# EAGLE schematic 20150319_QSE_TO_FMC_DP_R5.6_FOR_REVIEW (EAGLE 7.2.0), part 1 of 2

## Sheet 1 of 5: HS Diff Links
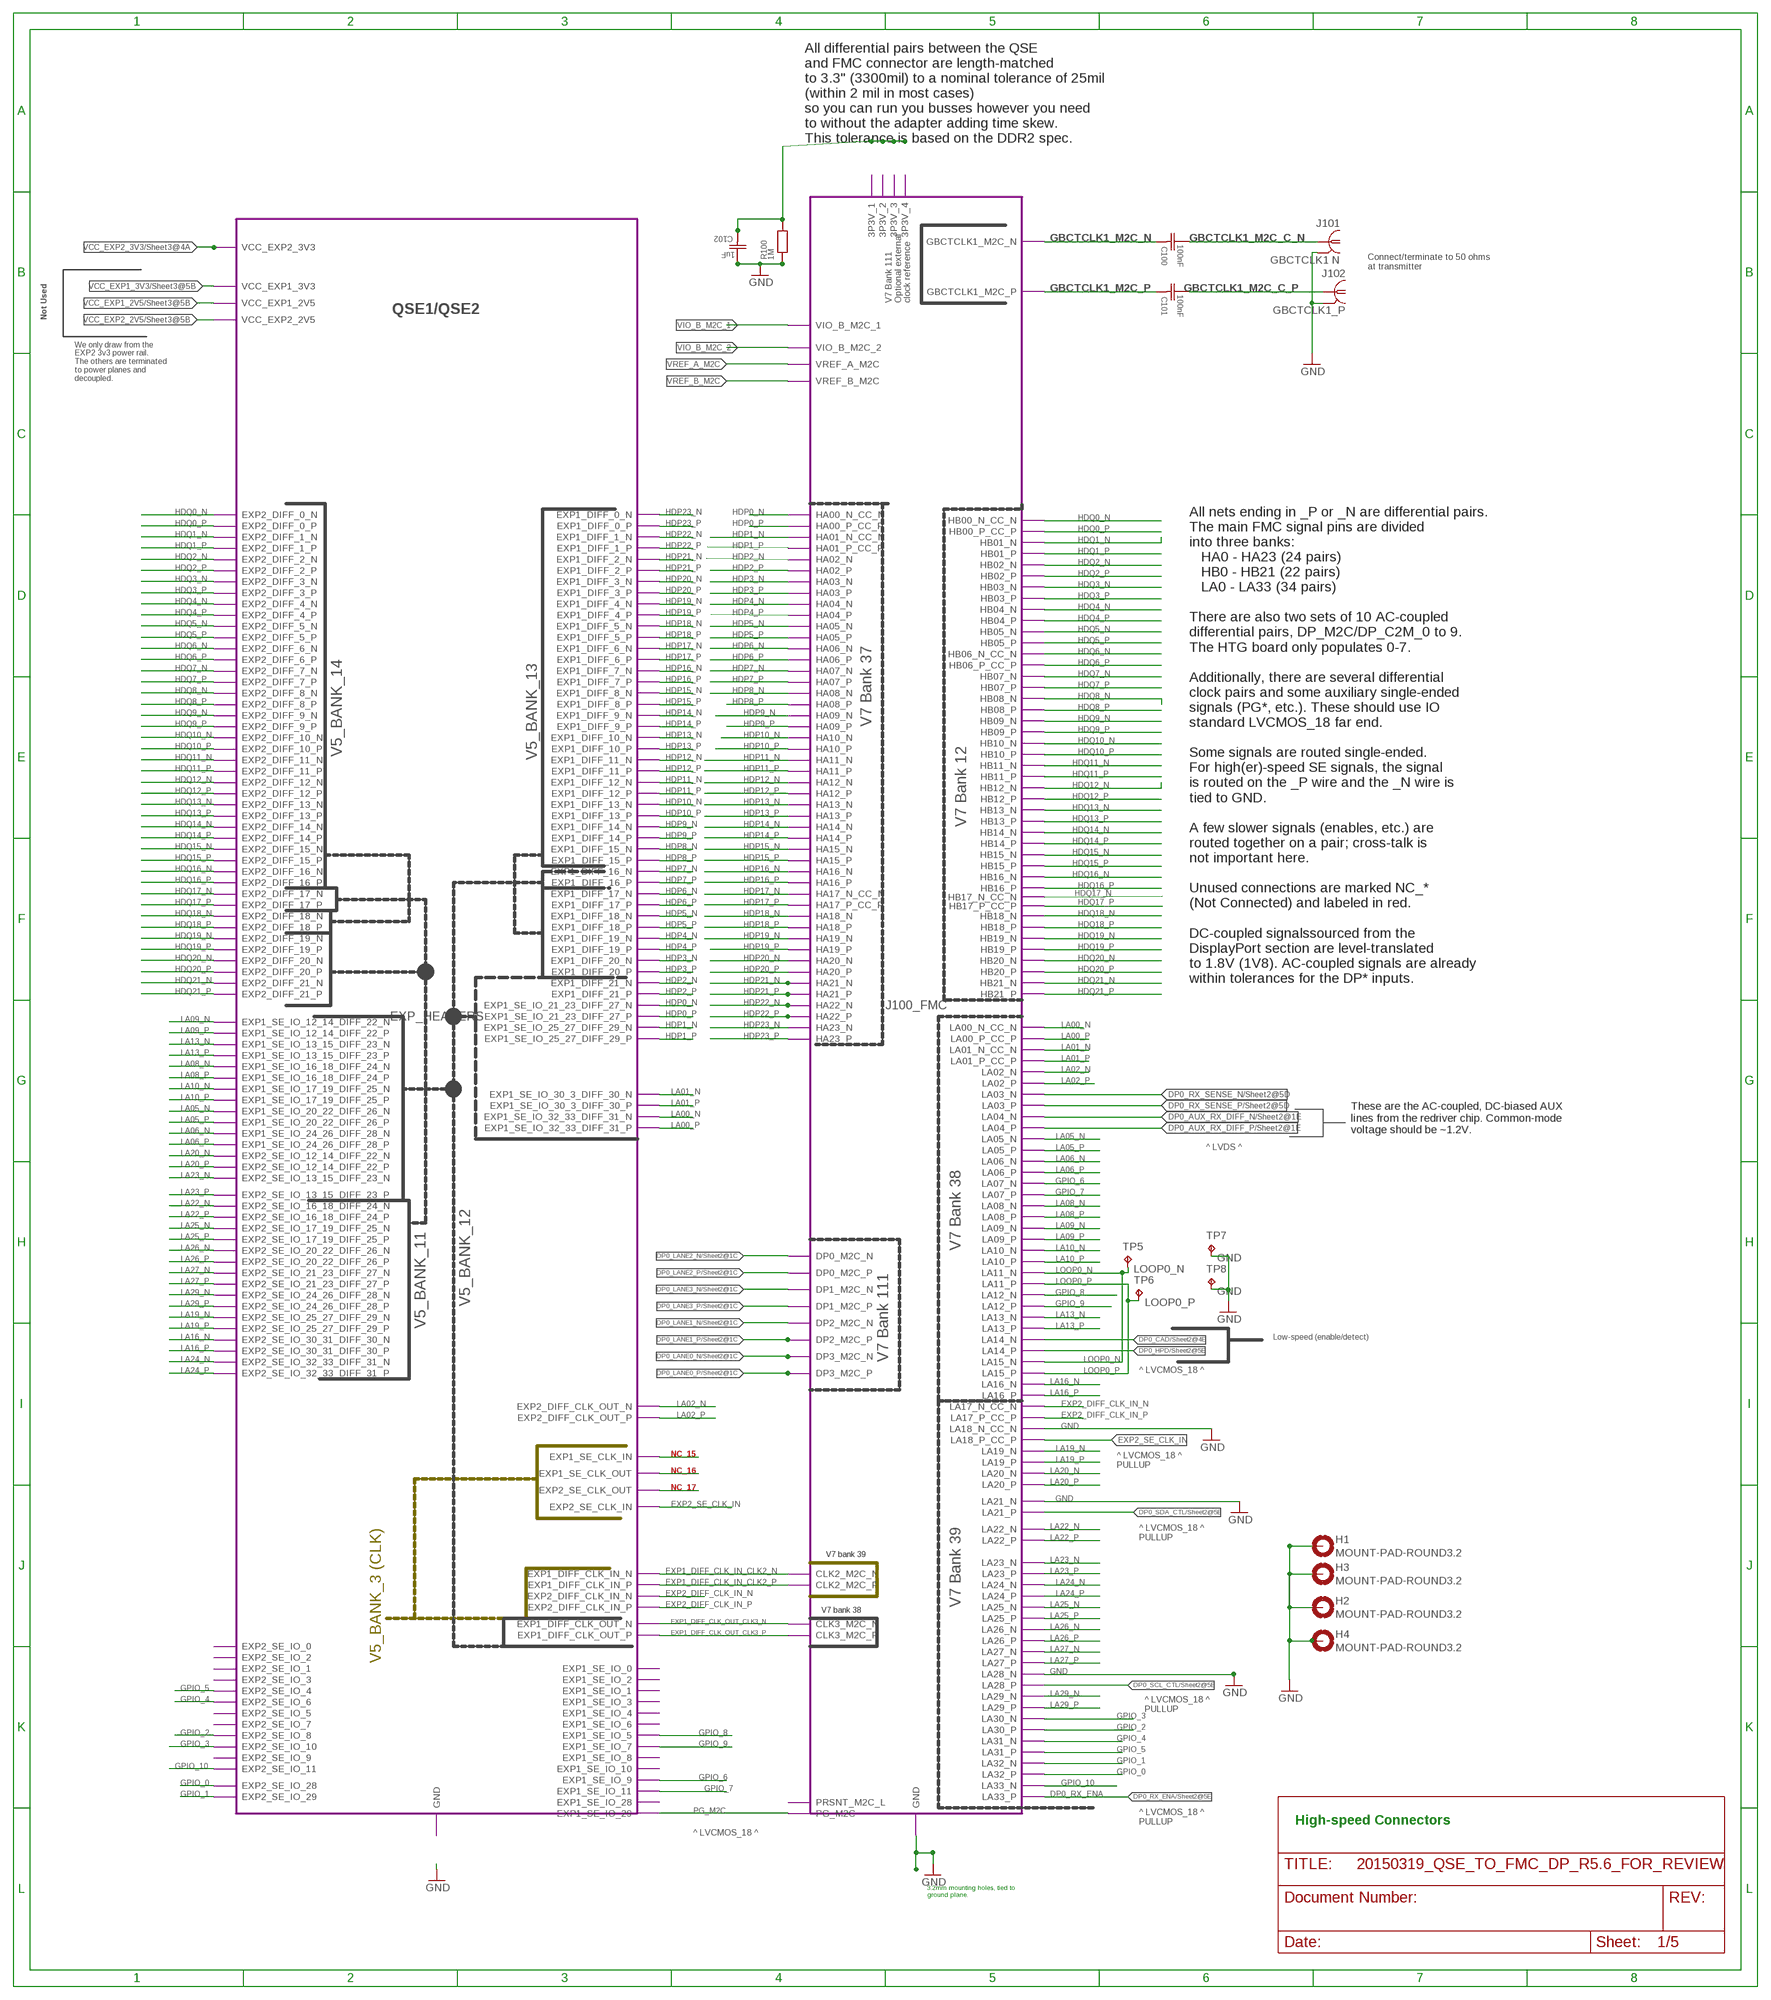
[diagram p0: schematic, sheet 1]

### Parts
C100  100nF  GRM155R71C104KA88D  [CAPC1005X60N]
C101  100nF  GRM155R71C104KA88D  [CAPC1005X60N]
C102  1uF  GRM155R61A105KE15D  [CAPC1005X60N]
H1  MOUNT-PAD-ROUND3.2  [3,2-PAD]
H2  MOUNT-PAD-ROUND3.2  [3,2-PAD]
H3  MOUNT-PAD-ROUND3.2  [3,2-PAD]
H4  MOUNT-PAD-ROUND3.2  [3,2-PAD]
J101  GBCTCLK1 N  SMA-SMD  [SMA-SMD]
J102  GBCTCLK1_P  SMA-SMD  [SMA-SMD]
R100  1M  CRCW04021M00JNED  [RESC1005X40N]
TP5  LOOP0_N  TPTP06R  [TP06R]
TP6  LOOP0_P  TPTP06R  [TP06R]
TP7  GND  TPTP06R  [TP06R]
TP8  GND  TPTP06R  [TP06R]

### Module instances
EXP_HEADERS = EXT_1_EXT_2 (part numbers offset by 400)
J100_FMC = FMC1

### Nets
DP0_AUX_RX_DIFF_N [diff_sig]: port J100_FMC.LA04_N ; also sheet 2
DP0_AUX_RX_DIFF_P [diff_sig]: port J100_FMC.LA04_P ; also sheet 2
DP0_CAD [gen_sig]: port J100_FMC.LA14_N ; also sheet 2
DP0_HPD [gen_sig]: port J100_FMC.LA14_P ; also sheet 2
DP0_LANE0_N [diff_sig]: port J100_FMC.DP3_M2C_N ; also sheet 2
DP0_LANE0_P [diff_sig]: port J100_FMC.DP3_M2C_P ; also sheet 2
DP0_LANE1_N [diff_sig]: port J100_FMC.DP2_M2C_N ; also sheet 2
DP0_LANE1_P [diff_sig]: port J100_FMC.DP2_M2C_P ; also sheet 2
DP0_LANE2_N [diff_sig]: port J100_FMC.DP0_M2C_N ; also sheet 2
DP0_LANE2_P [diff_sig]: port J100_FMC.DP0_M2C_P ; also sheet 2
DP0_LANE3_N [diff_sig]: port J100_FMC.DP1_M2C_N ; also sheet 2
DP0_LANE3_P [diff_sig]: port J100_FMC.DP1_M2C_P ; also sheet 2
DP0_RX_ENA [gen_sig]: port J100_FMC.LA33_P ; also sheet 2
DP0_RX_SENSE_N [diff_sig]: port J100_FMC.LA03_N ; also sheet 2
DP0_RX_SENSE_P [diff_sig]: port J100_FMC.LA03_P ; also sheet 2
DP0_SCL_CTL [gen_sig]: port J100_FMC.LA28_P ; also sheet 2
DP0_SDA_CTL [gen_sig]: port J100_FMC.LA21_P ; also sheet 2
EXP1_DIFF_CLK_IN_CLK2_N [diff_sig]: port J100_FMC.CLK2_M2C_N EXP_HEADERS.EXP1_DIFF_CLK_IN_N
EXP1_DIFF_CLK_IN_CLK2_P [diff_sig]: port EXP_HEADERS.EXP1_DIFF_CLK_IN_P J100_FMC.CLK2_M2C_P
EXP1_DIFF_CLK_OUT_CLK3_N [diff_sig]: port J100_FMC.CLK3_M2C_N EXP_HEADERS.EXP1_DIFF_CLK_OUT_N
EXP1_DIFF_CLK_OUT_CLK3_P [diff_sig]: port J100_FMC.CLK3_M2C_P EXP_HEADERS.EXP1_DIFF_CLK_OUT_P
EXP2_DIFF_CLK_IN_N [diff_sig]: port EXP_HEADERS.EXP2_DIFF_CLK_IN_N J100_FMC.LA17_N_CC_N
EXP2_DIFF_CLK_IN_P [diff_sig]: port EXP_HEADERS.EXP2_DIFF_CLK_IN_P J100_FMC.LA17_P_CC_P
EXP2_SE_CLK_IN [diff_sig]: port EXP_HEADERS.EXP2_SE_CLK_IN J100_FMC.LA18_P_CC_P
FMC_3PV3_TERM: C102.2 R100.1 ; port J100_FMC.3P3V_4 J100_FMC.3P3V_3 J100_FMC.3P3V_2 J100_FMC.3P3V_1
GBCTCLK1_M2C_C_N [DP]: C100.1 J101.1
GBCTCLK1_M2C_C_P [DP]: C101.1 J102.1
GBCTCLK1_M2C_N [diff_sig]: C100.2 ; port J100_FMC.GBCTCLK1_M2C_N
GBCTCLK1_M2C_P [diff_sig]: C101.2 ; port J100_FMC.GBCTCLK1_M2C_P
GND [GND]: C102.1 H1.B3,2(MOUNT) H2.B3,2(MOUNT) H3.B3,2(MOUNT) H4.B3,2(MOUNT) J101.2@1 J101.2@2 J101.2@3 J101.2@4 J101.2@5 J101.2@6 J102.2@1 J102.2@2 J102.2@3 J102.2@4 J102.2@5 J102.2@6 R100.2 TP7.TP TP8.TP ; port EXP_HEADERS.GND J100_FMC.GND J100_FMC.LA18_N_CC_N J100_FMC.LA28_N J100_FMC.LA21_N ; also sheet 2,3
GPIO_0 [DP]: port EXP_HEADERS.EXP2_SE_IO_28 J100_FMC.LA32_P
GPIO_1 [DP]: port EXP_HEADERS.EXP2_SE_IO_29 J100_FMC.LA32_N
GPIO_2 [DP]: port J100_FMC.LA30_P EXP_HEADERS.EXP2_SE_IO_8
GPIO_3 [DP]: port J100_FMC.LA30_N EXP_HEADERS.EXP2_SE_IO_10
GPIO_4 [DP]: port J100_FMC.LA31_N EXP_HEADERS.EXP2_SE_IO_6
GPIO_5 [DP]: port J100_FMC.LA31_P EXP_HEADERS.EXP2_SE_IO_4
GPIO_6 [DP]: port J100_FMC.LA07_N EXP_HEADERS.EXP1_SE_IO_9
GPIO_7 [DP]: port J100_FMC.LA07_P EXP_HEADERS.EXP1_SE_IO_11
GPIO_8 [DP]: port J100_FMC.LA12_N EXP_HEADERS.EXP1_SE_IO_5
GPIO_9 [DP]: port J100_FMC.LA12_P EXP_HEADERS.EXP1_SE_IO_7
GPIO_10 [DP]: port J100_FMC.LA33_N EXP_HEADERS.EXP2_SE_IO_11
HDP0_N [diff_sig]: port J100_FMC.HA00_N_CC_N EXP_HEADERS.EXP1_SE_IO_21_23_DIFF_27_N
HDP0_P [diff_sig]: port J100_FMC.HA00_P_CC_P EXP_HEADERS.EXP1_SE_IO_21_23_DIFF_27_P
HDP1_N [diff_sig]: port J100_FMC.HA01_N_CC_N EXP_HEADERS.EXP1_SE_IO_25_27_DIFF_29_N
HDP1_P [diff_sig]: port J100_FMC.HA01_P_CC_P EXP_HEADERS.EXP1_SE_IO_25_27_DIFF_29_P
HDP2_N [diff_sig]: port J100_FMC.HA02_N EXP_HEADERS.EXP1_DIFF_21_N
HDP2_P [diff_sig]: port J100_FMC.HA02_P EXP_HEADERS.EXP1_DIFF_21_P
HDP3_N [diff_sig]: port J100_FMC.HA03_N EXP_HEADERS.EXP1_DIFF_20_N
HDP3_P [diff_sig]: port J100_FMC.HA03_P EXP_HEADERS.EXP1_DIFF_20_P
HDP4_N [diff_sig]: port J100_FMC.HA04_N EXP_HEADERS.EXP1_DIFF_19_N
HDP4_P [diff_sig]: port J100_FMC.HA04_P EXP_HEADERS.EXP1_DIFF_19_P
HDP5_N [diff_sig]: port J100_FMC.HA05_N EXP_HEADERS.EXP1_DIFF_18_N
HDP5_P [diff_sig]: port J100_FMC.HA05_P EXP_HEADERS.EXP1_DIFF_18_P
HDP6_N [diff_sig]: port J100_FMC.HA06_N EXP_HEADERS.EXP1_DIFF_17_N
HDP6_P [diff_sig]: port J100_FMC.HA06_P EXP_HEADERS.EXP1_DIFF_17_P
HDP7_N [diff_sig]: port J100_FMC.HA07_N EXP_HEADERS.EXP1_DIFF_16_N
HDP7_P [diff_sig]: port J100_FMC.HA07_P EXP_HEADERS.EXP1_DIFF_16_P
HDP8_N [diff_sig]: port J100_FMC.HA08_N EXP_HEADERS.EXP1_DIFF_15_N
HDP8_P [diff_sig]: port J100_FMC.HA08_P EXP_HEADERS.EXP1_DIFF_15_P
HDP9_N [diff_sig]: port J100_FMC.HA09_N EXP_HEADERS.EXP1_DIFF_14_N
HDP9_P [diff_sig]: port J100_FMC.HA09_P EXP_HEADERS.EXP1_DIFF_14_P
HDP10_N [diff_sig]: port J100_FMC.HA10_N EXP_HEADERS.EXP1_DIFF_13_N
HDP10_P [diff_sig]: port J100_FMC.HA10_P EXP_HEADERS.EXP1_DIFF_13_P
HDP11_N [diff_sig]: port J100_FMC.HA11_N EXP_HEADERS.EXP1_DIFF_12_N
HDP11_P [diff_sig]: port J100_FMC.HA11_P EXP_HEADERS.EXP1_DIFF_12_P
HDP12_N [diff_sig]: port J100_FMC.HA12_N EXP_HEADERS.EXP1_DIFF_11_N
HDP12_P [diff_sig]: port J100_FMC.HA12_P EXP_HEADERS.EXP1_DIFF_11_P
HDP13_N [diff_sig]: port J100_FMC.HA13_N EXP_HEADERS.EXP1_DIFF_10_N
HDP13_P [diff_sig]: port J100_FMC.HA13_P EXP_HEADERS.EXP1_DIFF_10_P
HDP14_N [diff_sig]: port J100_FMC.HA14_N EXP_HEADERS.EXP1_DIFF_9_N
HDP14_P [diff_sig]: port J100_FMC.HA14_P EXP_HEADERS.EXP1_DIFF_9_P
HDP15_N [diff_sig]: port J100_FMC.HA15_N EXP_HEADERS.EXP1_DIFF_8_N
HDP15_P [diff_sig]: port J100_FMC.HA15_P EXP_HEADERS.EXP1_DIFF_8_P
HDP16_N [diff_sig]: port J100_FMC.HA16_N EXP_HEADERS.EXP1_DIFF_7_N
HDP16_P [diff_sig]: port J100_FMC.HA16_P EXP_HEADERS.EXP1_DIFF_7_P
HDP17_N [diff_sig]: port J100_FMC.HA17_N_CC_N EXP_HEADERS.EXP1_DIFF_6_N
HDP17_P [diff_sig]: port J100_FMC.HA17_P_CC_P EXP_HEADERS.EXP1_DIFF_6_P
HDP18_N [diff_sig]: port J100_FMC.HA18_N EXP_HEADERS.EXP1_DIFF_5_N
HDP18_P [diff_sig]: port J100_FMC.HA18_P EXP_HEADERS.EXP1_DIFF_5_P
HDP19_N [diff_sig]: port J100_FMC.HA19_N EXP_HEADERS.EXP1_DIFF_4_N
HDP19_P [diff_sig]: port J100_FMC.HA19_P EXP_HEADERS.EXP1_DIFF_4_P
HDP20_N [diff_sig]: port J100_FMC.HA20_N EXP_HEADERS.EXP1_DIFF_3_N
HDP20_P [diff_sig]: port J100_FMC.HA20_P EXP_HEADERS.EXP1_DIFF_3_P
HDP21_N [diff_sig]: port J100_FMC.HA21_N EXP_HEADERS.EXP1_DIFF_2_N
HDP21_P [diff_sig]: port J100_FMC.HA21_P EXP_HEADERS.EXP1_DIFF_2_P
HDP22_N [diff_sig]: port J100_FMC.HA22_N EXP_HEADERS.EXP1_DIFF_1_N
HDP22_P [diff_sig]: port J100_FMC.HA22_P EXP_HEADERS.EXP1_DIFF_1_P
HDP23_N [diff_sig]: port J100_FMC.HA23_N EXP_HEADERS.EXP1_DIFF_0_N
HDP23_P [diff_sig]: port J100_FMC.HA23_P EXP_HEADERS.EXP1_DIFF_0_P
HDQ0_N [diff_sig]: port J100_FMC.HB00_N_CC_N EXP_HEADERS.EXP2_DIFF_0_N
HDQ0_P [diff_sig]: port J100_FMC.HB00_P_CC_P EXP_HEADERS.EXP2_DIFF_0_P
HDQ1_N [diff_sig]: port J100_FMC.HB01_N EXP_HEADERS.EXP2_DIFF_1_N
HDQ1_P [diff_sig]: port J100_FMC.HB01_P EXP_HEADERS.EXP2_DIFF_1_P
HDQ2_N [diff_sig]: port J100_FMC.HB02_N EXP_HEADERS.EXP2_DIFF_2_N
HDQ2_P [diff_sig]: port J100_FMC.HB02_P EXP_HEADERS.EXP2_DIFF_2_P
HDQ3_N [diff_sig]: port J100_FMC.HB03_N EXP_HEADERS.EXP2_DIFF_3_N
HDQ3_P [diff_sig]: port J100_FMC.HB03_P EXP_HEADERS.EXP2_DIFF_3_P
HDQ4_N [diff_sig]: port J100_FMC.HB04_N EXP_HEADERS.EXP2_DIFF_4_N
HDQ4_P [diff_sig]: port J100_FMC.HB04_P EXP_HEADERS.EXP2_DIFF_4_P
HDQ5_N [diff_sig]: port J100_FMC.HB05_N EXP_HEADERS.EXP2_DIFF_5_N
HDQ5_P [diff_sig]: port J100_FMC.HB05_P EXP_HEADERS.EXP2_DIFF_5_P
HDQ6_N [diff_sig]: port J100_FMC.HB06_N_CC_N EXP_HEADERS.EXP2_DIFF_6_N
HDQ6_P [diff_sig]: port J100_FMC.HB06_P_CC_P EXP_HEADERS.EXP2_DIFF_6_P
HDQ7_N [diff_sig]: port J100_FMC.HB07_N EXP_HEADERS.EXP2_DIFF_7_N
HDQ7_P [diff_sig]: port J100_FMC.HB07_P EXP_HEADERS.EXP2_DIFF_7_P
HDQ8_N [diff_sig]: port J100_FMC.HB08_N EXP_HEADERS.EXP2_DIFF_8_N
HDQ8_P [diff_sig]: port J100_FMC.HB08_P EXP_HEADERS.EXP2_DIFF_8_P
HDQ9_N [diff_sig]: port J100_FMC.HB09_N EXP_HEADERS.EXP2_DIFF_9_N
HDQ9_P [diff_sig]: port J100_FMC.HB09_P EXP_HEADERS.EXP2_DIFF_9_P
HDQ10_N [diff_sig]: port J100_FMC.HB10_N EXP_HEADERS.EXP2_DIFF_10_N
HDQ10_P [diff_sig]: port J100_FMC.HB10_P EXP_HEADERS.EXP2_DIFF_10_P
HDQ11_N [diff_sig]: port J100_FMC.HB11_N EXP_HEADERS.EXP2_DIFF_11_N
HDQ11_P [diff_sig]: port J100_FMC.HB11_P EXP_HEADERS.EXP2_DIFF_11_P
HDQ12_N [diff_sig]: port J100_FMC.HB12_N EXP_HEADERS.EXP2_DIFF_12_N
HDQ12_P [diff_sig]: port J100_FMC.HB12_P EXP_HEADERS.EXP2_DIFF_12_P
HDQ13_N [diff_sig]: port J100_FMC.HB13_N EXP_HEADERS.EXP2_DIFF_13_N
HDQ13_P [diff_sig]: port J100_FMC.HB13_P EXP_HEADERS.EXP2_DIFF_13_P
HDQ14_N [diff_sig]: port J100_FMC.HB14_N EXP_HEADERS.EXP2_DIFF_14_N
HDQ14_P [diff_sig]: port J100_FMC.HB14_P EXP_HEADERS.EXP2_DIFF_14_P
HDQ15_N [diff_sig]: port J100_FMC.HB15_N EXP_HEADERS.EXP2_DIFF_15_N
HDQ15_P [diff_sig]: port J100_FMC.HB15_P EXP_HEADERS.EXP2_DIFF_15_P
HDQ16_N [diff_sig]: port J100_FMC.HB16_N EXP_HEADERS.EXP2_DIFF_16_N
HDQ16_P [diff_sig]: port J100_FMC.HB16_P EXP_HEADERS.EXP2_DIFF_16_P
HDQ17_N [diff_sig]: port J100_FMC.HB17_N_CC_N EXP_HEADERS.EXP2_DIFF_17_N
HDQ17_P [diff_sig]: port J100_FMC.HB17_P_CC_P EXP_HEADERS.EXP2_DIFF_17_P
HDQ18_N [diff_sig]: port J100_FMC.HB18_N EXP_HEADERS.EXP2_DIFF_18_N
HDQ18_P [diff_sig]: port J100_FMC.HB18_P EXP_HEADERS.EXP2_DIFF_18_P
HDQ19_N [diff_sig]: port J100_FMC.HB19_N EXP_HEADERS.EXP2_DIFF_19_N
HDQ19_P [diff_sig]: port J100_FMC.HB19_P EXP_HEADERS.EXP2_DIFF_19_P
HDQ20_N [diff_sig]: port J100_FMC.HB20_N EXP_HEADERS.EXP2_DIFF_20_N
HDQ20_P [diff_sig]: port J100_FMC.HB20_P EXP_HEADERS.EXP2_DIFF_20_P
HDQ21_N [diff_sig]: port J100_FMC.HB21_N EXP_HEADERS.EXP2_DIFF_21_N
HDQ21_P [diff_sig]: port J100_FMC.HB21_P EXP_HEADERS.EXP2_DIFF_21_P
LA00_N [diff_sig]: port J100_FMC.LA00_N_CC_N EXP_HEADERS.EXP1_SE_IO_32_33_DIFF_31_N
LA00_P [diff_sig]: port J100_FMC.LA00_P_CC_P EXP_HEADERS.EXP1_SE_IO_32_33_DIFF_31_P
LA01_N [diff_sig]: port J100_FMC.LA01_N_CC_N EXP_HEADERS.EXP1_SE_IO_30_3_DIFF_30_N
LA01_P [diff_sig]: port J100_FMC.LA01_P_CC_P EXP_HEADERS.EXP1_SE_IO_30_3_DIFF_30_P
LA02_N [diff_sig]: port J100_FMC.LA02_N EXP_HEADERS.EXP2_DIFF_CLK_OUT_N
LA02_P [diff_sig]: port J100_FMC.LA02_P EXP_HEADERS.EXP2_DIFF_CLK_OUT_P
LA05_N [diff_sig]: port J100_FMC.LA05_N EXP_HEADERS.EXP1_SE_IO_20_22_DIFF_26_N
LA05_P [diff_sig]: port J100_FMC.LA05_P EXP_HEADERS.EXP1_SE_IO_20_22_DIFF_26_P
LA06_N [diff_sig]: port J100_FMC.LA06_N EXP_HEADERS.EXP1_SE_IO_24_26_DIFF_28_N
LA06_P [diff_sig]: port J100_FMC.LA06_P EXP_HEADERS.EXP1_SE_IO_24_26_DIFF_28_P
LA08_N [diff_sig]: port J100_FMC.LA08_N EXP_HEADERS.EXP1_SE_IO_16_18_DIFF_24_N
LA08_P [diff_sig]: port J100_FMC.LA08_P EXP_HEADERS.EXP1_SE_IO_16_18_DIFF_24_P
LA09_N [diff_sig]: port J100_FMC.LA09_N EXP_HEADERS.EXP1_SE_IO_12_14_DIFF_22_N
LA09_P [diff_sig]: port J100_FMC.LA09_P EXP_HEADERS.EXP1_SE_IO_12_14_DIFF_22_P
LA10_N [diff_sig]: port J100_FMC.LA10_N EXP_HEADERS.EXP1_SE_IO_17_19_DIFF_25_N
LA10_P [diff_sig]: port J100_FMC.LA10_P EXP_HEADERS.EXP1_SE_IO_17_19_DIFF_25_P
LA13_N [diff_sig]: port J100_FMC.LA13_N EXP_HEADERS.EXP1_SE_IO_13_15_DIFF_23_N
LA13_P [diff_sig]: port J100_FMC.LA13_P EXP_HEADERS.EXP1_SE_IO_13_15_DIFF_23_P
LA16_N [diff_sig]: port J100_FMC.LA16_N EXP_HEADERS.EXP2_SE_IO_30_31_DIFF_30_N
LA16_P [diff_sig]: port J100_FMC.LA16_P EXP_HEADERS.EXP2_SE_IO_30_31_DIFF_30_P
LA19_N [diff_sig]: port J100_FMC.LA19_N EXP_HEADERS.EXP2_SE_IO_25_27_DIFF_29_N
LA19_P [diff_sig]: port J100_FMC.LA19_P EXP_HEADERS.EXP2_SE_IO_25_27_DIFF_29_P
LA20_N [diff_sig]: port EXP_HEADERS.EXP2_SE_IO_12_14_DIFF_22_N J100_FMC.LA20_N
LA20_P [diff_sig]: port EXP_HEADERS.EXP2_SE_IO_12_14_DIFF_22_P J100_FMC.LA20_P
LA22_N [diff_sig]: port J100_FMC.LA22_N EXP_HEADERS.EXP2_SE_IO_16_18_DIFF_24_N
LA22_P [diff_sig]: port J100_FMC.LA22_P EXP_HEADERS.EXP2_SE_IO_16_18_DIFF_24_P
LA23_N [diff_sig]: port J100_FMC.LA23_N EXP_HEADERS.EXP2_SE_IO_13_15_DIFF_23_N
LA23_P [diff_sig]: port EXP_HEADERS.EXP2_SE_IO_13_15_DIFF_23_P J100_FMC.LA23_P
LA24_N [diff_sig]: port J100_FMC.LA24_N EXP_HEADERS.EXP2_SE_IO_32_33_DIFF_31_N
LA24_P [diff_sig]: port J100_FMC.LA24_P EXP_HEADERS.EXP2_SE_IO_32_33_DIFF_31_P
LA25_N [diff_sig]: port EXP_HEADERS.EXP2_SE_IO_17_19_DIFF_25_N J100_FMC.LA25_N
LA25_P [diff_sig]: port EXP_HEADERS.EXP2_SE_IO_17_19_DIFF_25_P J100_FMC.LA25_P
LA26_N [diff_sig]: port EXP_HEADERS.EXP2_SE_IO_20_22_DIFF_26_N J100_FMC.LA26_N
LA26_P [diff_sig]: port EXP_HEADERS.EXP2_SE_IO_20_22_DIFF_26_P J100_FMC.LA26_P
LA27_N [diff_sig]: port EXP_HEADERS.EXP2_SE_IO_21_23_DIFF_27_N J100_FMC.LA27_N
LA27_P [diff_sig]: port EXP_HEADERS.EXP2_SE_IO_21_23_DIFF_27_P J100_FMC.LA27_P
LA29_N [diff_sig]: port EXP_HEADERS.EXP2_SE_IO_24_26_DIFF_28_N J100_FMC.LA29_N
LA29_P [diff_sig]: port EXP_HEADERS.EXP2_SE_IO_24_26_DIFF_28_P J100_FMC.LA29_P
LOOP0_N [diff_sig]: TP5.TP ; port J100_FMC.LA15_N J100_FMC.LA11_N
LOOP0_P [diff_sig]: TP6.TP ; port J100_FMC.LA11_P J100_FMC.LA15_P
NC_15 [DP]: port EXP_HEADERS.EXP1_SE_CLK_IN
NC_16 [DP]: port EXP_HEADERS.EXP1_SE_CLK_OUT
NC_17 [DP]: port EXP_HEADERS.EXP2_SE_CLK_OUT
PG_M2C [gen_sig]: port J100_FMC.PG_M2C EXP_HEADERS.EXP1_SE_IO_29
VCC_EXP1_2V5: port EXP_HEADERS.VCC_EXP1_2V5 ; also sheet 3
VCC_EXP1_3V3: port EXP_HEADERS.VCC_EXP1_3V3 ; also sheet 3
VCC_EXP2_2V5 [power]: port EXP_HEADERS.VCC_EXP2_2V5 ; also sheet 3
VCC_EXP2_3V3 [power]: port EXP_HEADERS.VCC_EXP2_3V3 ; also sheet 3
VIO_B_M2C_1: port J100_FMC.VIO_B_M2C_1
VIO_B_M2C_2: port J100_FMC.VIO_B_M2C_2
VREF_A_M2C: port J100_FMC.VREF_A_M2C
VREF_B_M2C: port J100_FMC.VREF_B_M2C

### Notes on the sheet
- All differential pairs between the QSE
  and FMC connector are length-matched
  to 3.3" (3300mil) to a nominal tolerance of 25mil
  (within 2 mil in most cases)
  so you can run you busses however you need 
  to without the adapter adding time skew. 
  This tolerance is based on the DDR2 spec.
- Connect/terminate to 50 ohms 
  at transmitter
- V7 Bank 111 
  Optional external
  clock reference
- QSE1/QSE2
- Not Used
- We only draw from the 
  EXP2 3v3 power rail.
  The others are terminated 
  to power planes and 
  decoupled.
- V5_BANK_14
- V7 Bank 37
- V5_BANK_13
- V7 Bank 12
- All nets ending in _P or _N are differential pairs. 
  The main FMC signal pins are divided 
  into three banks:
     HA0 - HA23 (24 pairs)
     HB0 - HB21 (22 pairs)
     LA0 - LA33 (34 pairs)
  
  There are also two sets of 10 AC-coupled
  differential pairs, DP_M2C/DP_C2M_0 to 9.
  The HTG board only populates 0-7.
  
  Additionally, there are several differential
  clock pairs and some auxiliary single-ended
  signals (PG*, etc.). These should use IO
  standard LVCMOS_18 far end.
  
  Some signals are routed single-ended.
  For high(er)-speed SE signals, the signal
  is routed on the _P wire and the _N wire is
  tied to GND.
  
  A few slower signals (enables, etc.) are 
  routed together on a pair; cross-talk is
  not important here.
  
  Unused connections are marked NC_* 
  (Not Connected) and labeled in red.
  
  DC-coupled signalssourced from the
  DisplayPort section are level-translated
  to 1.8V (1V8). AC-coupled signals are already
  within tolerances for the DP* inputs.
- These are the AC-coupled, DC-biased AUX
  lines from the redriver chip. Common-mode
  voltage should be ~1.2V.
- ^ LVDS ^
- V7 Bank 38
- V5_BANK_12
- V5_BANK_11
- Low-speed (enable/detect)
- V7 Bank 111
- ^ LVCMOS_18 ^
- ^ LVCMOS_18 ^
  PULLUP
- ^ LVCMOS_18 ^
  PULLUP
- V7 bank 39
- V7 Bank 39
- V7 bank 38
- V5_BANK_3 (CLK)
- ^ LVCMOS_18 ^
  PULLUP
- ^ LVCMOS_18 ^
  PULLUP
- High-speed Connectors
- ^ LVCMOS_18 ^
- 3.2mm mounting holes, tied to
  ground plane.

## Sheet 2 of 5: DisplayPort Circuitry
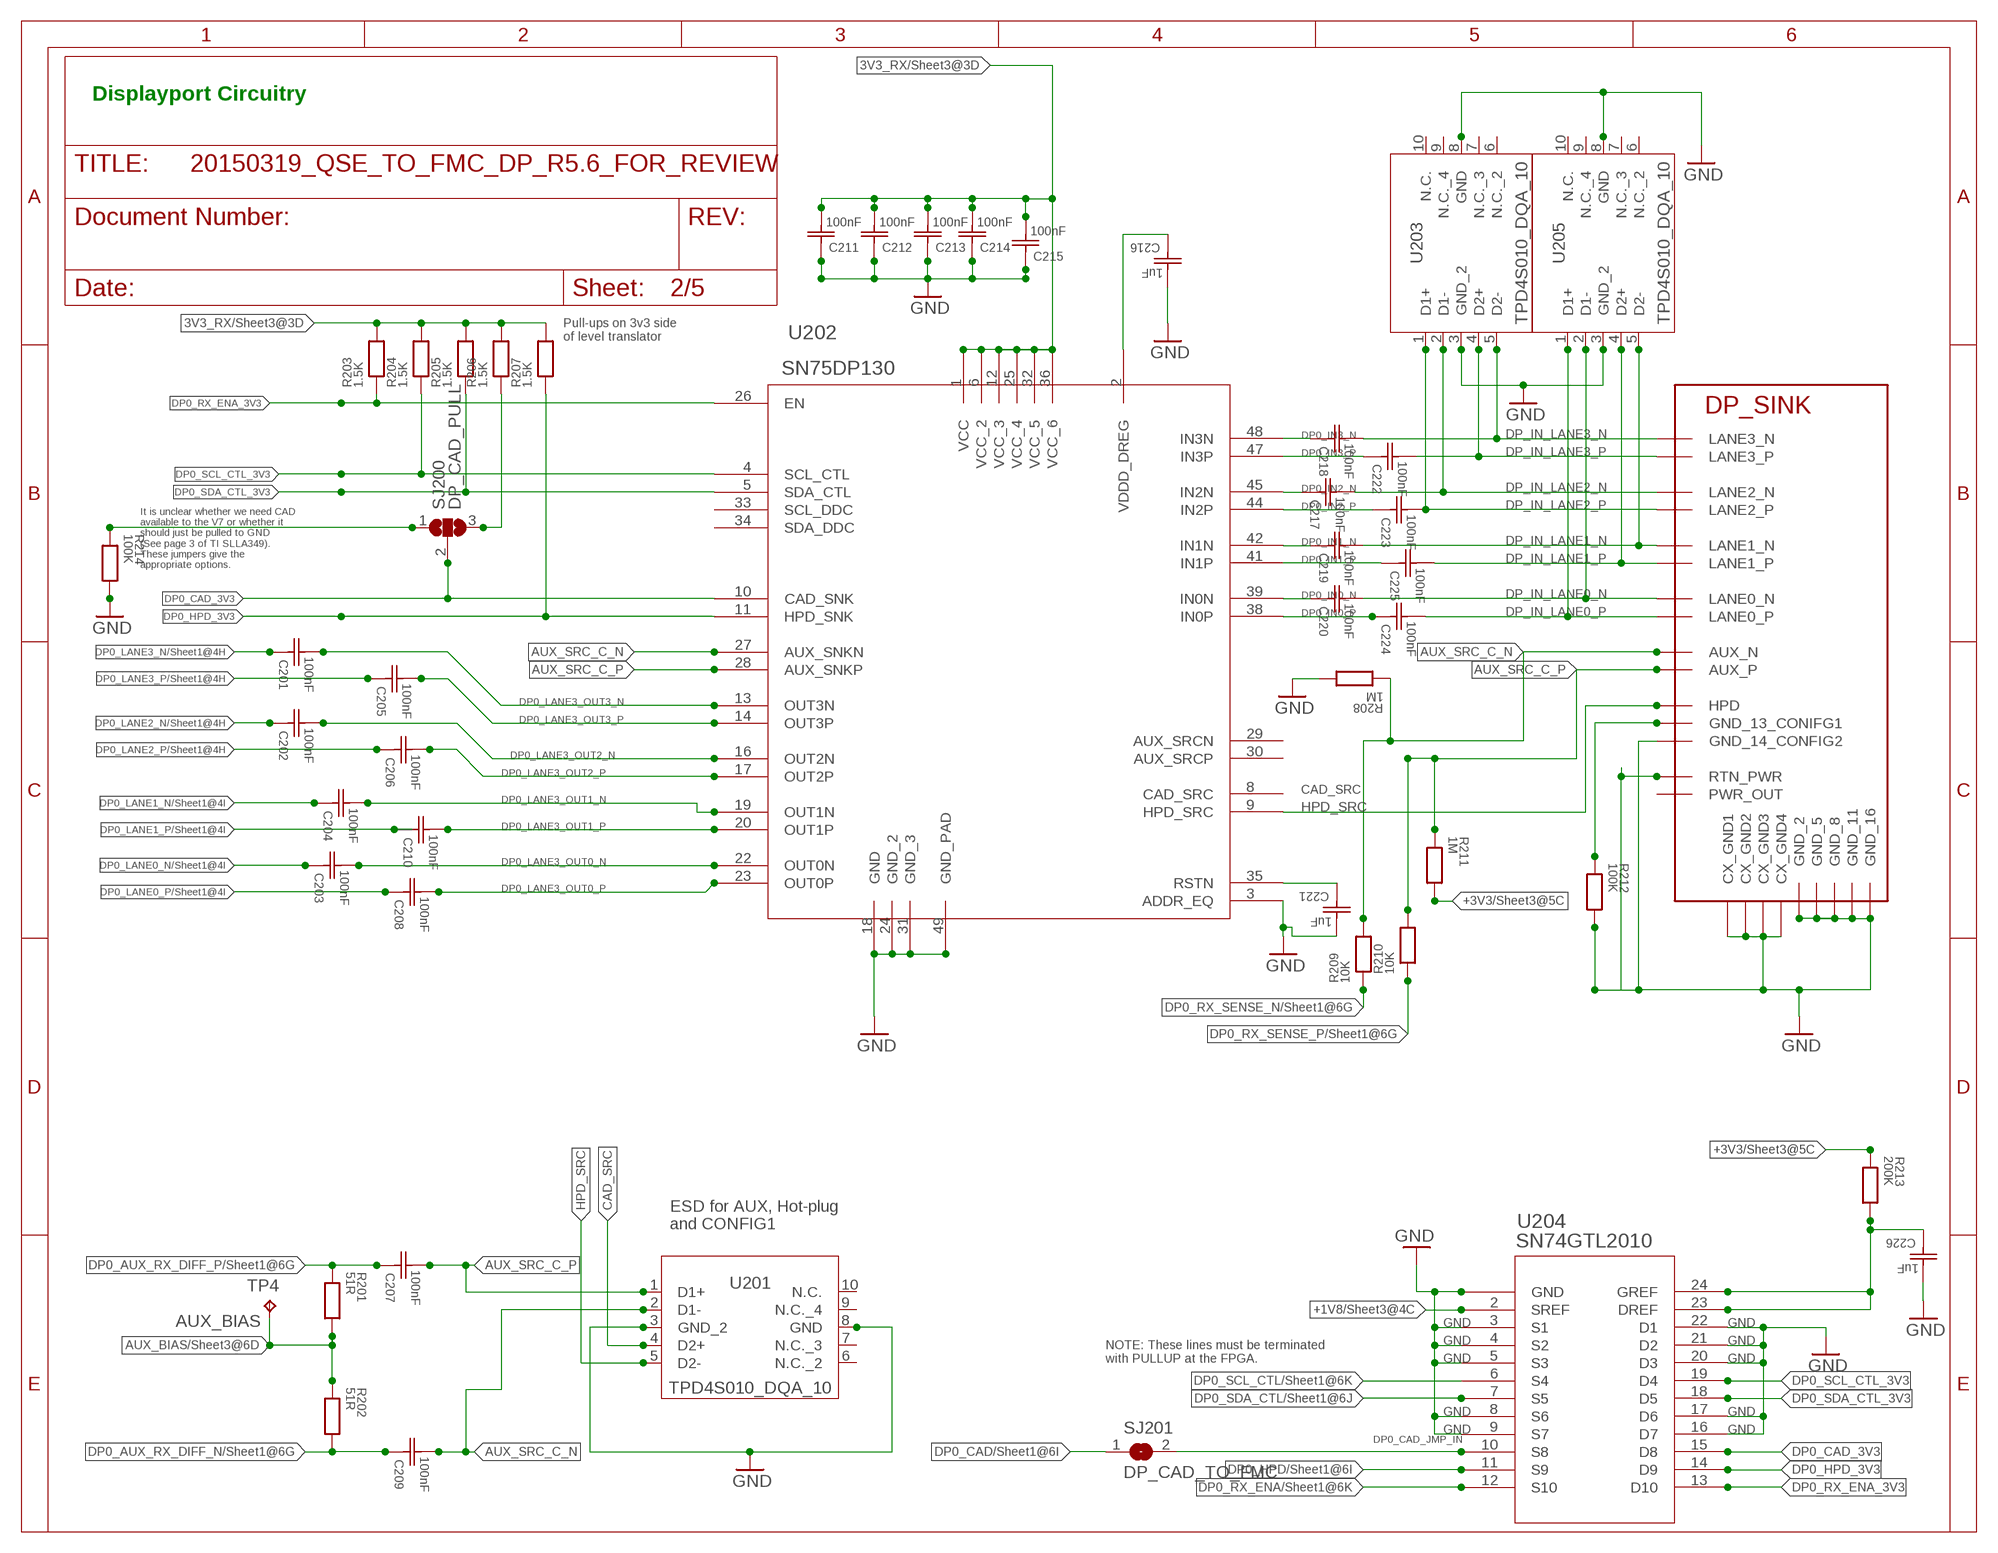
[diagram p1: schematic, sheet 2]

### Parts
C201  100nF  GRM155R71C104KA88D  [CAPC1005X60N]
C202  100nF  GRM155R71C104KA88D  [CAPC1005X60N]
C203  100nF  GRM155R71C104KA88D  [CAPC1005X60N]
C204  100nF  GRM155R71C104KA88D  [CAPC1005X60N]
C205  100nF  GRM155R71C104KA88D  [CAPC1005X60N]
C206  100nF  GRM155R71C104KA88D  [CAPC1005X60N]
C207  100nF  GRM155R71C104KA88D  [CAPC1005X60N]
C208  100nF  GRM155R71C104KA88D  [CAPC1005X60N]
C209  100nF  GRM155R71C104KA88D  [CAPC1005X60N]
C210  100nF  GRM155R71C104KA88D  [CAPC1005X60N]
C211  100nF  GRM155R71C104KA88D  [CAPC1005X60N]
C212  100nF  GRM155R71C104KA88D  [CAPC1005X60N]
C213  100nF  GRM155R71C104KA88D  [CAPC1005X60N]
C214  100nF  GRM155R71C104KA88D  [CAPC1005X60N]
C215  100nF  GRM155R71C104KA88D  [CAPC1005X60N]
C216  1uF  GRM155R61A105KE15D  [CAPC1005X60N]
C217  100nF  GRM155R71C104KA88D  [CAPC1005X60N]
C218  100nF  GRM155R71C104KA88D  [CAPC1005X60N]
C219  100nF  GRM155R71C104KA88D  [CAPC1005X60N]
C220  100nF  GRM155R71C104KA88D  [CAPC1005X60N]
C221  1uF  GRM155R61A105KE15D  [CAPC1005X60N]
C222  100nF  GRM155R71C104KA88D  [CAPC1005X60N]
C223  100nF  GRM155R71C104KA88D  [CAPC1005X60N]
C224  100nF  GRM155R71C104KA88D  [CAPC1005X60N]
C225  100nF  GRM155R71C104KA88D  [CAPC1005X60N]
C226  1uF  GRM155R61A105KE15D  [CAPC1005X60N]
R201  51R  CRCW040251R0FKED  [RESC1005X40N]
R202  51R  CRCW040251R0FKED  [RESC1005X40N]
R203  1.5K  CRCW04021K50FKED  [RESC1005X40N]
R204  1.5K  CRCW04021K50FKED  [RESC1005X40N]
R205  1.5K  CRCW04021K50FKED  [RESC1005X40N]
R206  1.5K  CRCW04021K50FKED  [RESC1005X40N]
R207  1.5K  CRCW04021K50FKED  [RESC1005X40N]
R208  1M  CRCW04021M00FKED  [RESC1005X40N]
R209  10K  CRCW040210K0JNED  [RESC1005X40N]
R210  10K  CRCW040210K0JNED  [RESC1005X40N]
R211  1M  CRCW04021M00FKED  [RESC1005X40N]
R212  100K  CRCW0402100KFKED  [RESC1005X40N]
R213  200K  CRCW0402200KJNED  [RESC1005X40N]
R214  100K  CRCW0402100KFKED  [RESC1005X40N]
SJ200  DP_CAD_PULL  SJ2W  [SJ_2]
SJ201  DP_CAD_TO_FMC  SJ  [SJ]
TP4  AUX_BIAS  TPTP10R  [TP10R]
U201  TPD4S010_DQA_10  [DQA10]
U202  SN75DP130  SN75DP130SN75DP130-SS  [RGZ48_5P6X5P6]
U203  TPD4S010_DQA_10  [DQA10]
U204  SN74GTL2010  SN74GTL2010_PW_24  [PW24]
U205  TPD4S010_DQA_10  [DQA10]
U206  DP0_IN  SD-47272DP_SINK  [SD-47272]

### Nets
3V3_RX [power]: C211.1 C212.1 C213.1 C214.1 C215.1 R203.1 R204.1 R205.1 R206.1 R207.1 U202.1(VCC) U202.6(VCC_2) U202.12(VCC_3) U202.25(VCC_4) U202.32(VCC_5) U202.36(VCC_6) ; also sheet 3
+1V8 [diff_sig]: U204.2(SREF) ; also sheet 3
+3V3 [power]: R211.1 R213.2 ; also sheet 3
AUX_BIAS [diff_sig]: R201.1 R202.2 TP4.TP ; also sheet 3
AUX_SRC_C_N [diff_sig]: C209.1 R208.2 R209.1 U201.2(D1-) U202.27(AUX_SNKN) U206.P$17(AUX_N)
AUX_SRC_C_P [diff_sig]: C207.1 R210.1 R211.2 U201.1(D1+) U202.28(AUX_SNKP) U206.P$15(AUX_P)
CAD_SRC [gen_sig]: R212.2 U201.4(D2+) U206.P$13(GND_13_CONIFG1)
DP0_AUX_RX_DIFF_N [diff_sig]: C209.2 R202.1 ; also sheet 1
DP0_AUX_RX_DIFF_P [diff_sig]: C207.2 R201.2 ; also sheet 1
DP0_CAD [gen_sig]: SJ201.1 ; also sheet 1
DP0_CAD_3V3 [diff_sig]: SJ200.2 U202.10(CAD_SNK) U204.15(D8)
DP0_CAD_JMP_IN [gen_sig]: SJ201.2 U204.10(S8)
DP0_HPD [gen_sig]: U204.11(S9) ; also sheet 1
DP0_HPD_3V3 [diff_sig]: R207.2 U202.11(HPD_SNK) U204.14(D9)
DP0_IN0_N [DP]: C220.2 U202.39(IN0N)
DP0_IN0_P [DP]: C224.2 U202.38(IN0P)
DP0_IN1_N [DP]: C219.2 U202.42(IN1N)
DP0_IN1_P [DP]: C225.2 U202.41(IN1P)
DP0_IN2_N [DP]: C217.2 U202.45(IN2N)
DP0_IN2_P [DP]: C223.2 U202.44(IN2P)
DP0_IN3_N [DP]: C218.2 U202.48(IN3N)
DP0_IN3_P [DP]: C222.2 U202.47(IN3P)
DP0_LANE0_N [diff_sig]: C203.2 ; also sheet 1
DP0_LANE0_P [diff_sig]: C208.2 ; also sheet 1
DP0_LANE1_N [diff_sig]: C204.2 ; also sheet 1
DP0_LANE1_P [diff_sig]: C210.2 ; also sheet 1
DP0_LANE2_N [diff_sig]: C202.2 ; also sheet 1
DP0_LANE2_P [diff_sig]: C206.2 ; also sheet 1
DP0_LANE3_N [diff_sig]: C201.2 ; also sheet 1
DP0_LANE3_OUT0_N [DP]: C203.1 U202.22(OUT0N)
DP0_LANE3_OUT0_P [DP]: C208.1 U202.23(OUT0P)
DP0_LANE3_OUT1_N [DP]: C204.1 U202.19(OUT1N)
DP0_LANE3_OUT1_P [DP]: C210.1 U202.20(OUT1P)
DP0_LANE3_OUT2_N [DP]: C202.1 U202.16(OUT2N)
DP0_LANE3_OUT2_P [DP]: C206.1 U202.17(OUT2P)
DP0_LANE3_OUT3_N [DP]: C201.1 U202.13(OUT3N)
DP0_LANE3_OUT3_P [DP]: C205.1 U202.14(OUT3P)
DP0_LANE3_P [diff_sig]: C205.2 ; also sheet 1
DP0_RX_ENA [gen_sig]: U204.12(S10) ; also sheet 1
DP0_RX_ENA_3V3 [diff_sig]: R203.2 U202.26(EN) U204.13(D10)
DP0_RX_SENSE_N [diff_sig]: R209.2 ; also sheet 1
DP0_RX_SENSE_P [diff_sig]: R210.2 ; also sheet 1
DP0_SCL_CTL [gen_sig]: U204.6(S4) ; also sheet 1
DP0_SCL_CTL_3V3 [gen_sig]: R204.2 U202.4(SCL_CTL) U204.19(D4)
DP0_SDA_CTL [gen_sig]: U204.7(S5) ; also sheet 1
DP0_SDA_CTL_3V3 [gen_sig]: R205.2 U202.5(SDA_CTL) U204.18(D5)
DP_IN_LANE0_N [DP]: C220.1 U205.2(D1-) U206.P$10(LANE0_N)
DP_IN_LANE0_P [DP]: C224.1 U205.1(D1+) U206.P$12(LANE0_P)
DP_IN_LANE1_N [DP]: C219.1 U205.5(D2-) U206.P$7(LANE1_N)
DP_IN_LANE1_P [DP]: C225.1 U205.4(D2+) U206.P$9(LANE1_P)
DP_IN_LANE2_N [DP]: C217.1 U203.2(D1-) U206.P$4(LANE2_N)
DP_IN_LANE2_P [DP]: C223.1 U203.1(D1+) U206.P$6(LANE2_P)
DP_IN_LANE3_N [DP]: C218.1 U203.5(D2-) U206.P$1(LANE3_N)
DP_IN_LANE3_P [DP]: C222.1 U203.4(D2+) U206.P$3(LANE3_P)
GND [GND]: C211.2 C212.2 C213.2 C214.2 C215.2 C216.1 C221.1 C226.1 R208.1 R212.1 R214.1 U201.3(GND_2) U201.8(GND) U202.3(ADDR_EQ) U202.18(GND) U202.24(GND_2) U202.31(GND_3) U202.49(GND_PAD) U203.3(GND_2) U203.8(GND) U204.1(GND) U204.3(S1) U204.4(S2) U204.5(S3) U204.8(S6) U204.9(S7) U204.16(D7) U204.17(D6) U204.20(D3) U204.21(D2) U204.22(D1) U205.3(GND_2) U205.8(GND) U206.P$2(GND_2) U206.P$5(GND_5) U206.P$8(GND_8) U206.P$11(GND_11) U206.P$14(GND_14_CONFIG2) U206.P$16(GND_16) U206.P$19(RTN_PWR) U206.P$21(CX_GND1) U206.P$22(CX_GND2) U206.P$23(CX_GND3) U206.P$24(CX_GND4) ; also sheet 1,3
HPD_SRC [gen_sig]: U201.5(D2-) U202.9(HPD_SRC) U206.P$18(HPD)
N$4 [diff_buried]: R206.2 SJ200.3
N$5: R214.2 SJ200.1
RSTN_SOFT_START: C221.2 U202.35(RSTN)
VDDD_DREG_DECOUPLE [gen_sig]: C216.2 U202.2(VDDD_DREG)
XLAT_3V3_BIAS [diff_sig]: C226.2 R213.1 U204.23(DREF) U204.24(GREF)
Unconnected: U201.6(N.C._2) U201.7(N.C._3) U201.9(N.C._4) U201.10(N.C.) U202.7(NC) U202.8(CAD_SRC) U202.15(NC_2) U202.21(NC_3) U202.29(AUX_SRCN) U202.30(AUX_SRCP) U202.33(SCL_DDC) U202.34(SDA_DDC) U202.37(NC_4) U202.40(NC_5) U202.43(NC_6) U202.46(NC_7) U203.6(N.C._2) U203.7(N.C._3) U203.9(N.C._4) U203.10(N.C.) U205.6(N.C._2) U205.7(N.C._3) U205.9(N.C._4) U205.10(N.C.)

### Notes on the sheet
- Displayport Circuitry
- Pull-ups on 3v3 side
  of level translator
- It is unclear whether we need CAD 
  available to the V7 or whether it
  should just be pulled to GND 
  (See page 3 of TI SLLA349).
  These jumpers give the 
  appropriate options.
- ESD for AUX, Hot-plug
  and CONFIG1
- NOTE: These lines must be terminated
  with PULLUP at the FPGA.

## Sheet 3 of 5: Power Stuff 3v3 supplies for DP logic, bias supplies, filtered analog rail, and decoupling.
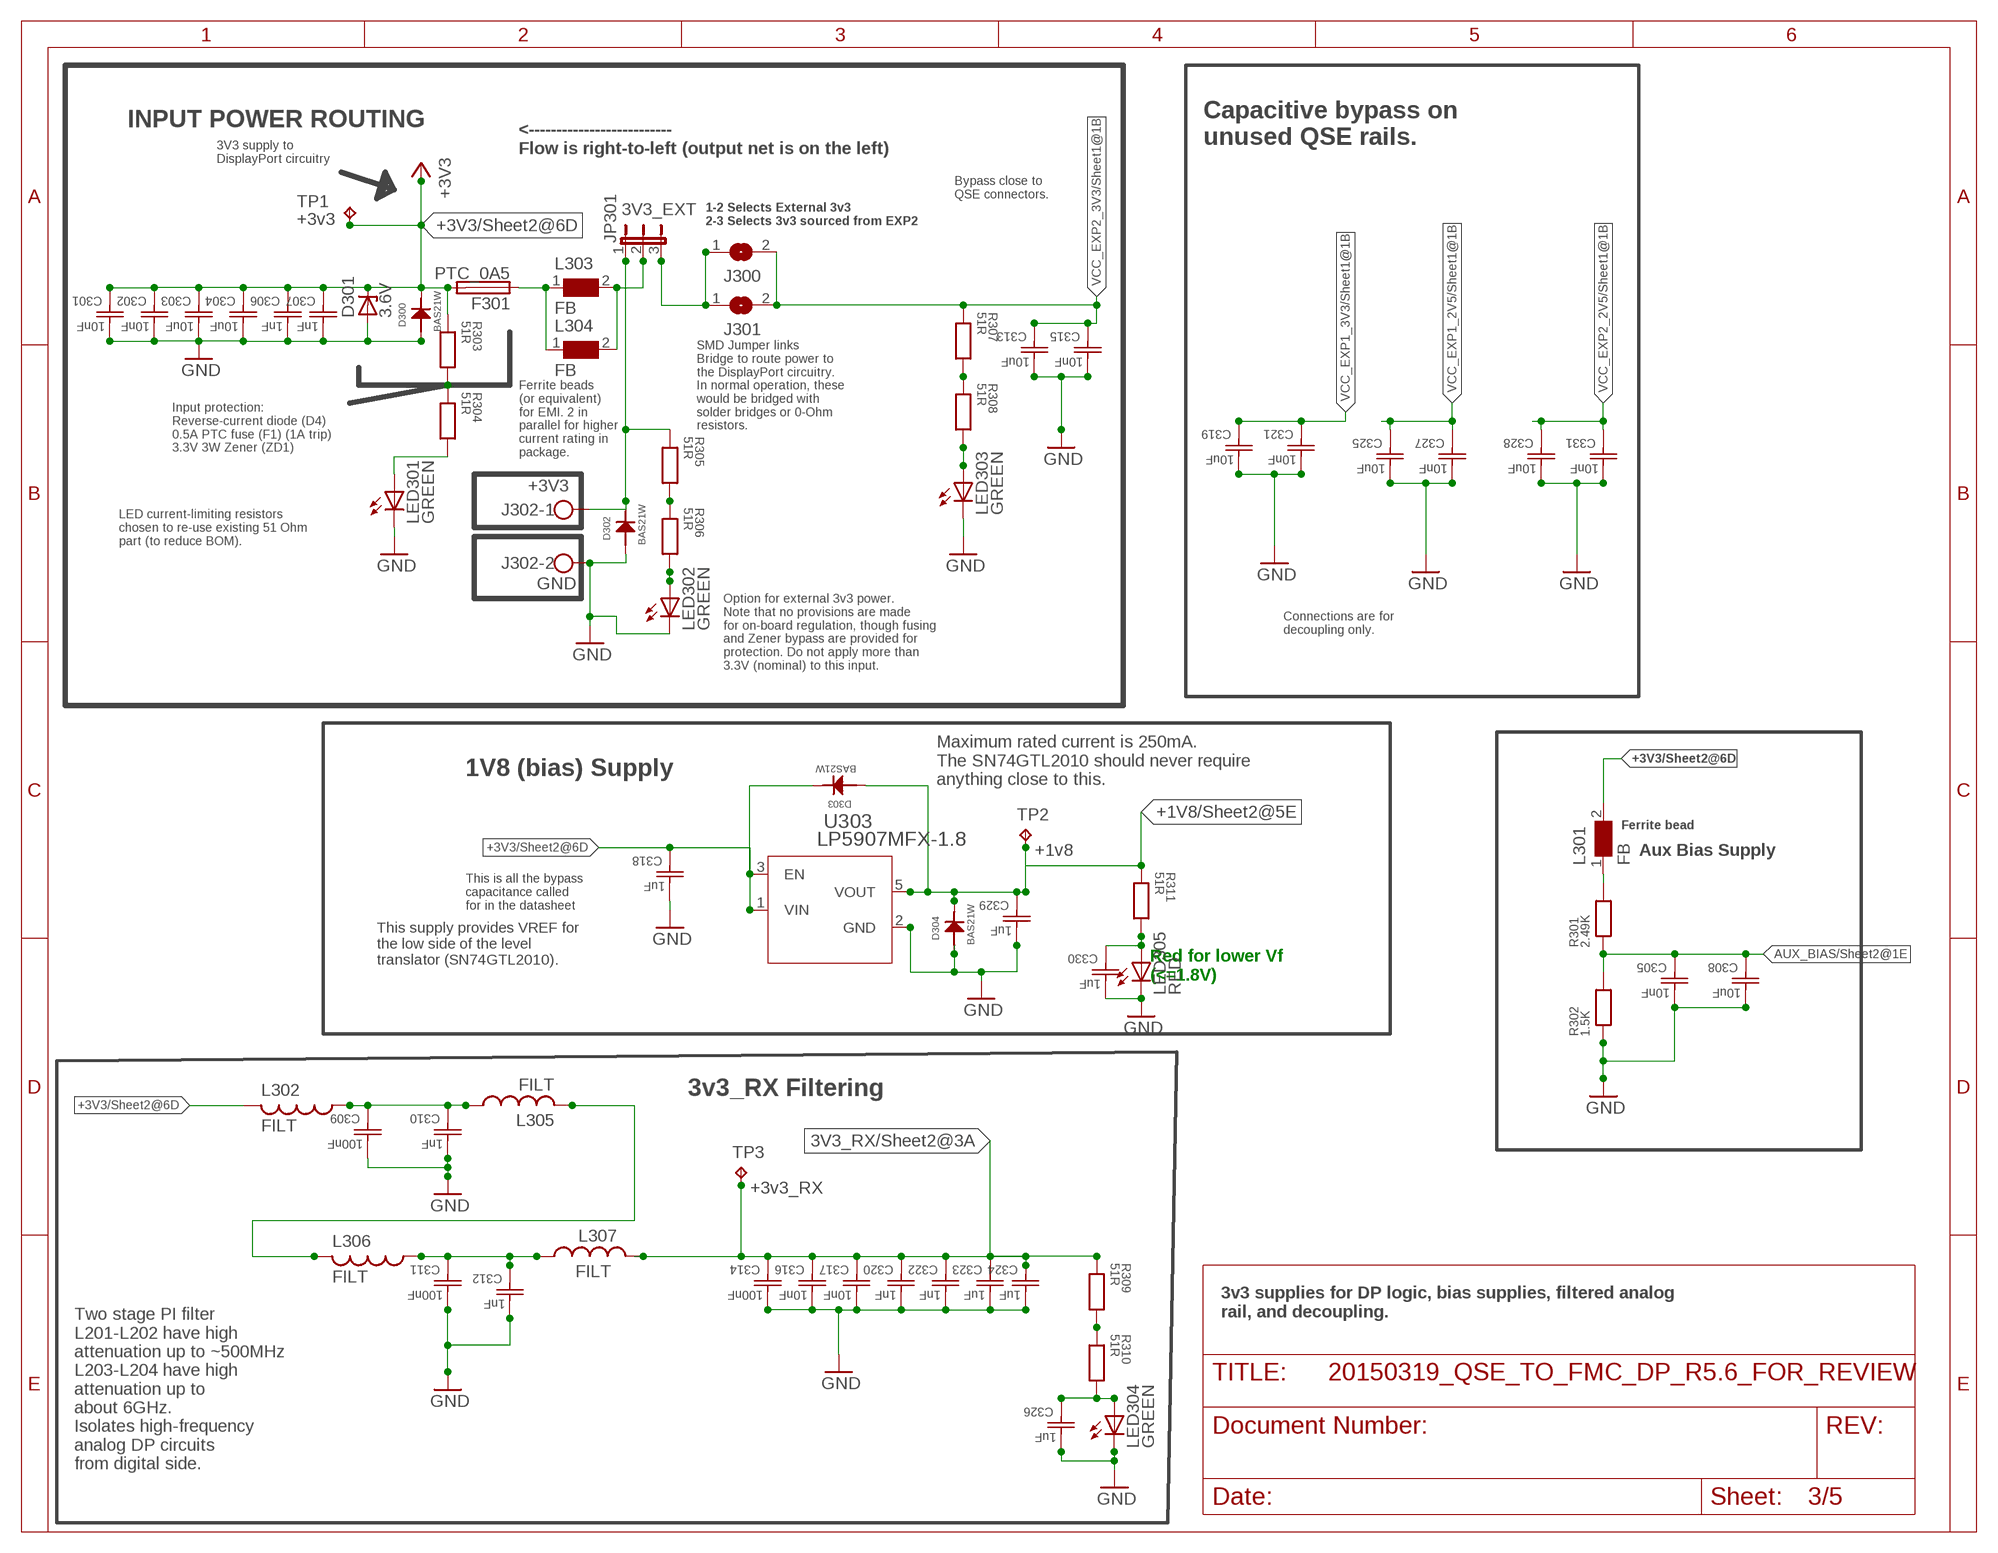
[diagram p2: schematic, sheet 3]

### Parts
C301  10nF  GRM155R71E103KA01D  [CAPC1005X60N]
C302  10nF  GRM155R71E103KA01D  [CAPC1005X60N]
C303  10uF  GRM188R60J106ME47D  [CAPC1608X85N]
C304  10uF  GRM188R60J106ME47D  [CAPC1608X85N]
C305  10nF  GRM155R71E103KA01D  [CAPC1005X60N]
C306  1nF  GRM1555C1H102JA01D  [CAPC1005X60N]
C307  1nF  GRM1555C1H102JA01D  [CAPC1005X60N]
C308  10uF  GRM188R60J106ME47D  [CAPC1608X85N]
C309  100nF  GRM155R71C104KA88D  [CAPC1005X60N]
C310  1nF  GRM1555C1H102JA01D  [CAPC1005X60N]
C311  100nF  GRM155R71C104KA88D  [CAPC1005X60N]
C312  1nF  GRM1555C1H102JA01D  [CAPC1005X60N]
C313  10uF  GRM188R60J106ME47D  [CAPC1608X85N]
C314  100nF  GRM155R71C104KA88D  [CAPC1005X60N]
C315  10nF  GRM188R71H103KA01D  [CAPC1608X85N]
C316  10nF  GRM155R71E103KA01D  [CAPC1005X60N]
C317  10nF  GRM155R71E103KA01D  [CAPC1005X60N]
C318  1uF  GRM155R61A105KE15D  [CAPC1005X60N]
C319  10uF  GRM188R60J106ME47D  [CAPC1608X85N]
C320  1nF  GRM1555C1H102JA01D  [CAPC1005X60N]
C321  10nF  GRM188R71H103KA01D  [CAPC1608X85N]
C322  1nF  GRM1555C1H102JA01D  [CAPC1005X60N]
C323  1uF  GRM155R61A105KE15D  [CAPC1005X60N]
C324  1uF  GRM155R61A105KE15D  [CAPC1005X60N]
C325  10uF  GRM188R60J106ME47D  [CAPC1608X85N]
C326  1uF  GRM155R61A105KE15D  [CAPC1005X60N]
C327  10nF  GRM188R71H103KA01D  [CAPC1608X85N]
C328  10uF  GRM188R60J106ME47D  [CAPC1608X85N]
C329  1uF  GRM155R61A105KE15D  [CAPC1005X60N]
C330  1uF  GRM155R61A105KE15D  [CAPC1005X60N]
C331  10nF  GRM188R71H103KA01D  [CAPC1608X85N]
D300  BAS21W  [SOT65P210X100-3N]
D301  3.6V  ZENER-DIODESMB  [SMB]
D302  BAS21W  [SOT65P210X100-3N]
D303  BAS21W  [SOT65P210X100-3N]
D304  BAS21W  [SOT65P210X100-3N]
F301  PTC_0A5  MF-SMDFSMD-0805  [SMD-0805]
J300  SJW  [SJW]
J301  SJW  [SJW]
J302  W237-102  [W237-102]
JP301  3V3_EXT  JP2E  [JP2]
L301  FB  WE-CBF_HF-742841210_0402  [0402]
L302  FILT  L-USL0603  [R0603]
L303  FB  WE-CBF-742792097_0805  [0805]
L304  FB  WE-CBF-742792097_0805  [0805]
L305  FILT  L-USL0603  [R0603]
L306  FILT  L-USL0603  [R0603]
L307  FILT  L-USL0603  [R0603]
LED301  GREEN  LEDCHIP-LED0805  [CHIP-LED0805]
LED302  GREEN  LEDCHIP-LED0805  [CHIP-LED0805]
LED303  GREEN  LEDCHIP-LED0805  [CHIP-LED0805]
LED304  GREEN  LEDCHIP-LED0805  [CHIP-LED0805]
LED305  RED  LEDSML0603  [SML0603]
R301  2.49K  CRCW04022K49FKED  [RESC1005X40N]
R302  1.5K  CRCW04021K50FKED  [RESC1005X40N]
R303  51R  CRCW040251R0FKED  [RESC1005X40N]
R304  51R  CRCW040251R0FKED  [RESC1005X40N]
R305  51R  CRCW040251R0FKED  [RESC1005X40N]
R306  51R  CRCW040251R0FKED  [RESC1005X40N]
R307  51R  CRCW040251R0FKED  [RESC1005X40N]
R308  51R  CRCW040251R0FKED  [RESC1005X40N]
R309  51R  CRCW040251R0FKED  [RESC1005X40N]
R310  51R  CRCW040251R0FKED  [RESC1005X40N]
R311  51R  CRCW040251R0FKED  [RESC1005X40N]
TP1  +3v3  TPTP10R  [TP10R]
TP2  +1v8  TPTP10R  [TP10R]
TP3  +3v3_RX  TPTP10R  [TP10R]
U303  LP5907MFX-1.8  LP5907_DBV_5  [DBV5]

### Nets
1V8_LED: C330.2 LED305.A R311.1
3V3_EXP_JP [power]: D302.3(C) J302.1 JP301.1 R305.2
3V3_IN_FILTER_TO_FUSE [gen_sig]: F301.1 L303.1 L304.1
3V3_INT_JP [power]: J300.1 J301.1 JP301.3
3V3_INT_LED: LED303.A R308.1
3V3_RX [power]: C314.2 C316.2 C317.2 C320.2 C322.2 C323.2 C324.2 L307.2 R309.2 TP3.TP ; also sheet 2
3V3_RX_FILT_S0 [diff_sig]: C309.2 C310.2 L302.1 L305.1
3V3_RX_FILT_S1 [power]: L305.2 L306.2
3V3_RX_FILT_S2 [diff_sig]: C311.2 C312.2 L306.1 L307.1
3V3_RX_LED: C326.2 LED304.A R310.1
3V3_TO_AUX_BIAS_POST_FILTER: L301.1 R301.1
+1V8 [diff_sig]: C329.2 D303.1(A) D304.3(C) R311.2 TP2.TP U303.5(VOUT) ; also sheet 2
+3V3 [power]: C301.2 C302.2 C303.2 C304.2 C306.2 C307.2 C318.2 D300.3(C) D301.C D303.3(C) F301.2 L301.2 L302.2 R303.2 TP1.TP U303.1(VIN) U303.3(EN) ; also sheet 2
AUX_BIAS [diff_sig]: C305.2 C308.2 R301.2 R302.1 ; also sheet 2
EXT_3V3_LED: LED302.A R306.1
GND [GND]: C301.1 C302.1 C303.1 C304.1 C305.1 C306.1 C307.1 C308.1 C309.1 C310.1 C311.1 C312.1 C313.1 C314.1 C315.1 C316.1 C317.1 C318.1 C319.1 C320.1 C321.1 C322.1 C323.1 C324.1 C325.1 C326.1 C327.1 C328.1 C329.1 C330.1 C331.1 D300.1(A) D301.A D302.1(A) D304.1(A) J302.2 LED301.C LED302.C LED303.C LED304.C LED305.C R302.2 U303.2(GND) ; also sheet 1,2
MAIN_POWER_LED: LED301.A R304.1
R303_R304: R303.1 R304.2
R306_R305: R305.1 R306.2
R308_R307: R307.1 R308.2
R309_R310: R309.1 R310.2
SELECTED_3V3 [power]: JP301.2 L303.2 L304.2
VCC_EXP1_2V5: C325.2 C327.2 ; also sheet 1
VCC_EXP1_3V3: C319.2 C321.2 ; also sheet 1
VCC_EXP2_2V5 [power]: C328.2 C331.2 ; also sheet 1
VCC_EXP2_3V3 [power]: C313.2 C315.2 J300.2 J301.2 R307.2 ; also sheet 1
Unconnected: D300.2(NC) D302.2(NC) D303.2(NC) D304.2(NC) U303.4(NC)

### Notes on the sheet
- INPUT POWER ROUTING
- Capacitive bypass on
  unused QSE rails.
- <--------------------------
  Flow is right-to-left (output net is on the left)
- 3V3 supply to 
  DisplayPort circuitry
- Bypass close to
  QSE connectors.
- 1-2 Selects External 3v3
  2-3 Selects 3v3 sourced from EXP2
- SMD Jumper links
  Bridge to route power to 
  the DisplayPort circuitry.
  In normal operation, these 
  would be bridged with  
  solder bridges or 0-Ohm
  resistors.
- Ferrite beads 
  (or equivalent) 
  for EMI. 2 in 
  parallel for higher
  current rating in 
  package.
- Input protection:
  Reverse-current diode (D4)
  0.5A PTC fuse (F1) (1A trip)
  3.3V 3W Zener (ZD1)
- +3V3
- LED current-limiting resistors 
  chosen to re-use existing 51 Ohm
  part (to reduce BOM).
- GND
- Connections are for
  decoupling only.
- Option for external 3v3 power.
  Note that no provisions are made
  for on-board regulation, though fusing
  and Zener bypass are provided for 
  protection. Do not apply more than
  3.3V (nominal) to this input.
- 1V8 (bias) Supply
- Maximum rated current is 250mA. 
  The SN74GTL2010 should never require
  anything close to this.
- Ferrite bead
- Aux Bias Supply
- This is all the bypass 
  capacitance called
  for in the datasheet
- This supply provides VREF for 
  the low side of the level 
  translator (SN74GTL2010).
- Red for lower Vf
  (<=1.8V)
- 3v3_RX Filtering
- 3v3 supplies for DP logic, bias supplies, filtered analog
  rail, and decoupling.
- Two stage PI filter
  L201-L202 have high 
  attenuation up to ~500MHz
  L203-L204 have high 
  attenuation up to 
  about 6GHz. 
  Isolates high-frequency 
  analog DP circuits
  from digital side.

## Sheet 4 of 5
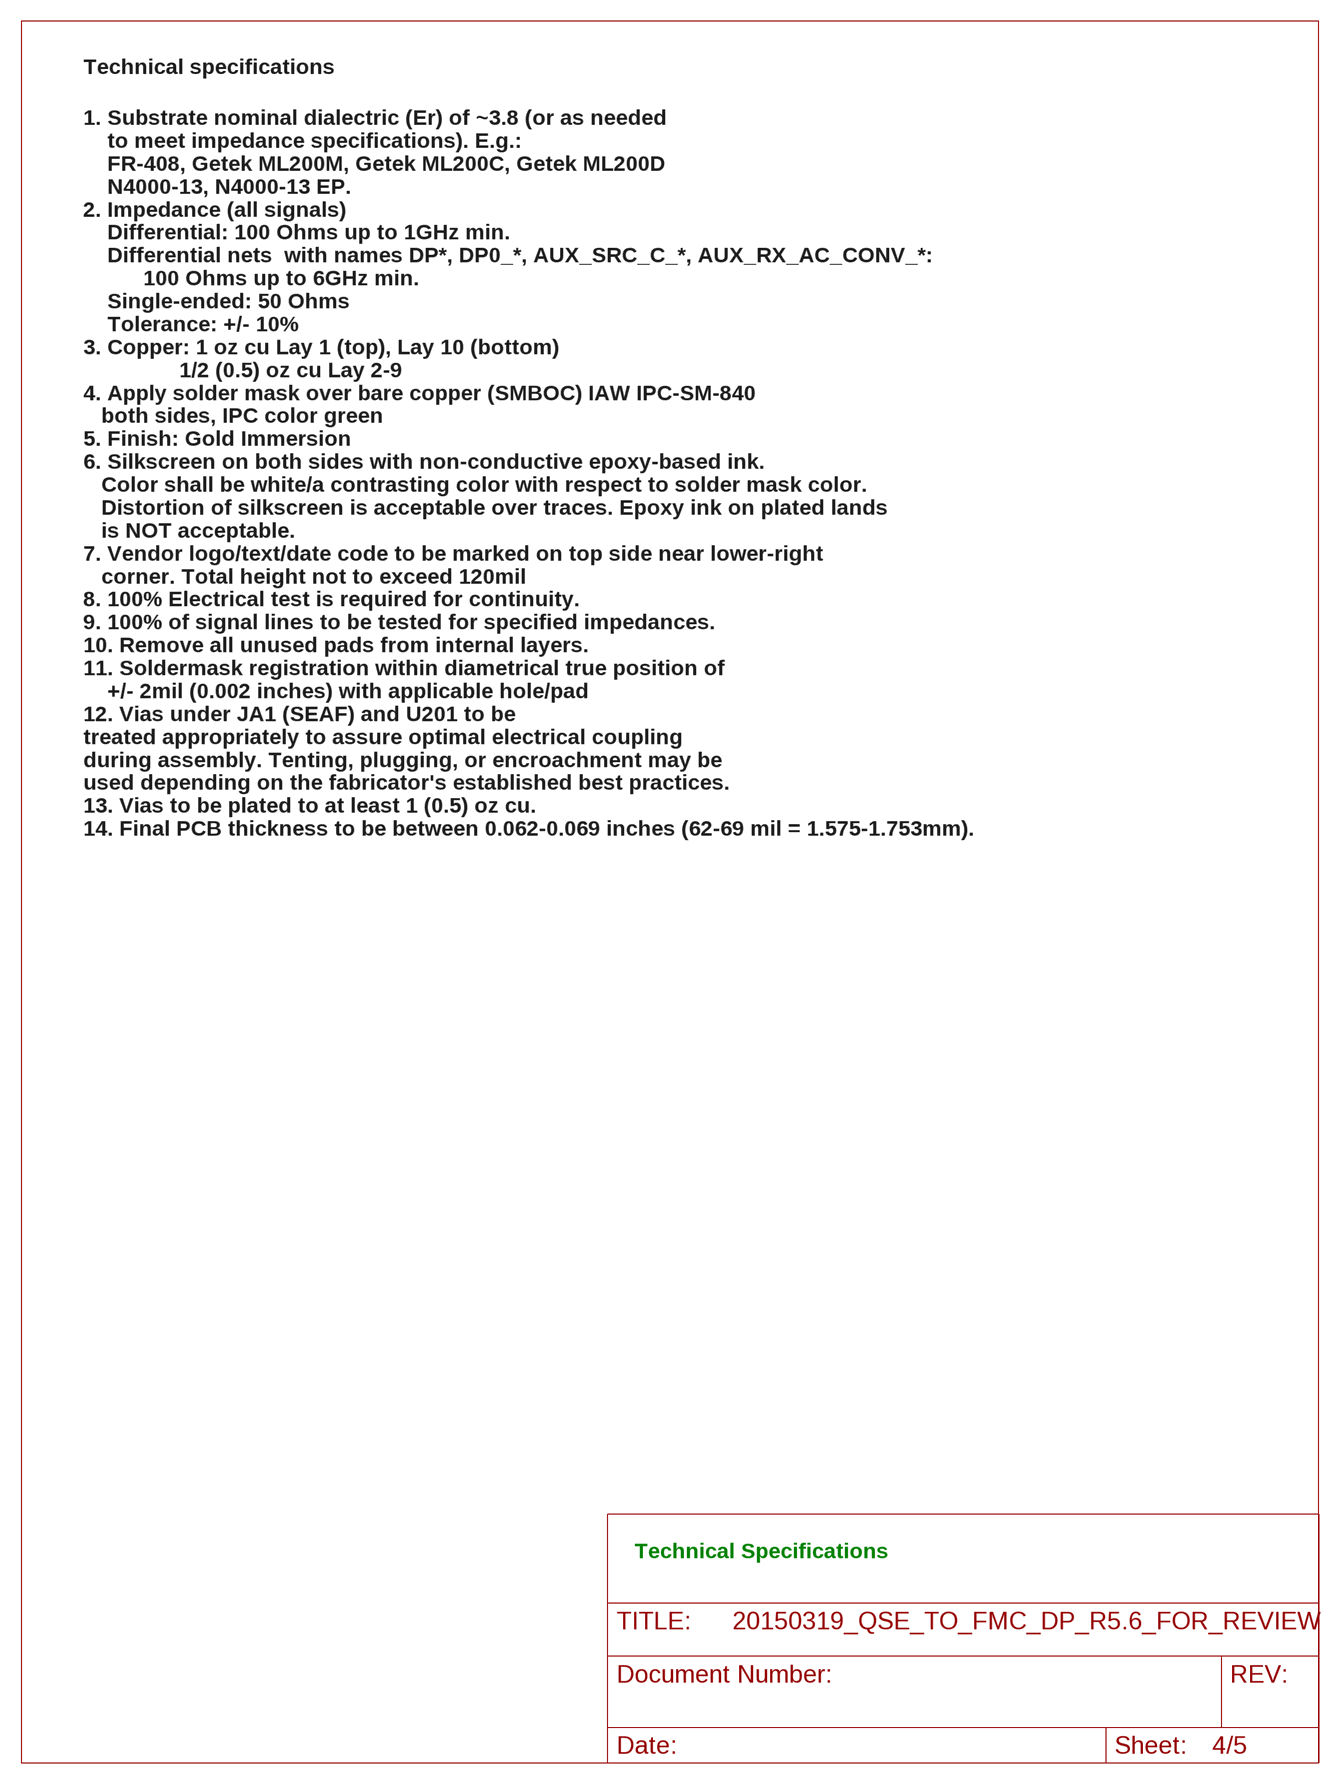
[diagram p3: schematic, sheet 4]

### Notes on the sheet
- Technical specifications
- 1. Substrate nominal dialectric (Er) of ~3.8 (or as needed
      to meet impedance specifications). E.g.:
      FR-408, Getek ML200M, Getek ML200C, Getek ML200D
      N4000-13, N4000-13 EP.
  2. Impedance (all signals)
      Differential: 100 Ohms up to 1GHz min.
      Differential nets  with names DP*, DP0_*, AUX_SRC_C_*, AUX_RX_AC_CONV_*: 
            100 Ohms up to 6GHz min.
      Single-ended: 50 Ohms
      Tolerance: +/- 10%
  3. Copper: 1 oz cu Lay 1 (top), Lay 10 (bottom)
                  1/2 (0.5) oz cu Lay 2-9
  4. Apply solder mask over bare copper (SMBOC) IAW IPC-SM-840
     both sides, IPC color green
  5. Finish: Gold Immersion
  6. Silkscreen on both sides with non-conductive epoxy-based ink.
     Color shall be white/a contrasting color with respect to solder mask color.
     Distortion of silkscreen is acceptable over traces. Epoxy ink on plated lands
     is NOT acceptable.
  7. Vendor logo/text/date code to be marked on top side near lower-right 
     corner. Total height not to exceed 120mil
  8. 100% Electrical test is required for continuity.
  9. 100% of signal lines to be tested for specified impedances. 
  10. Remove all unused pads from internal layers.
  11. Soldermask registration within diametrical true position of 
      +/- 2mil (0.002 inches) with applicable hole/pad
  12. Vias under JA1 (SEAF) and U201 to be 
  treated appropriately to assure optimal electrical coupling 
  during assembly. Tenting, plugging, or encroachment may be
  used depending on the fabricator's established best practices.
  13. Vias to be plated to at least 1 (0.5) oz cu.
  14. Final PCB thickness to be between 0.062-0.069 inches (62-69 mil = 1.575-1.753mm).
- Technical Specifications

## Sheet 5 of 5
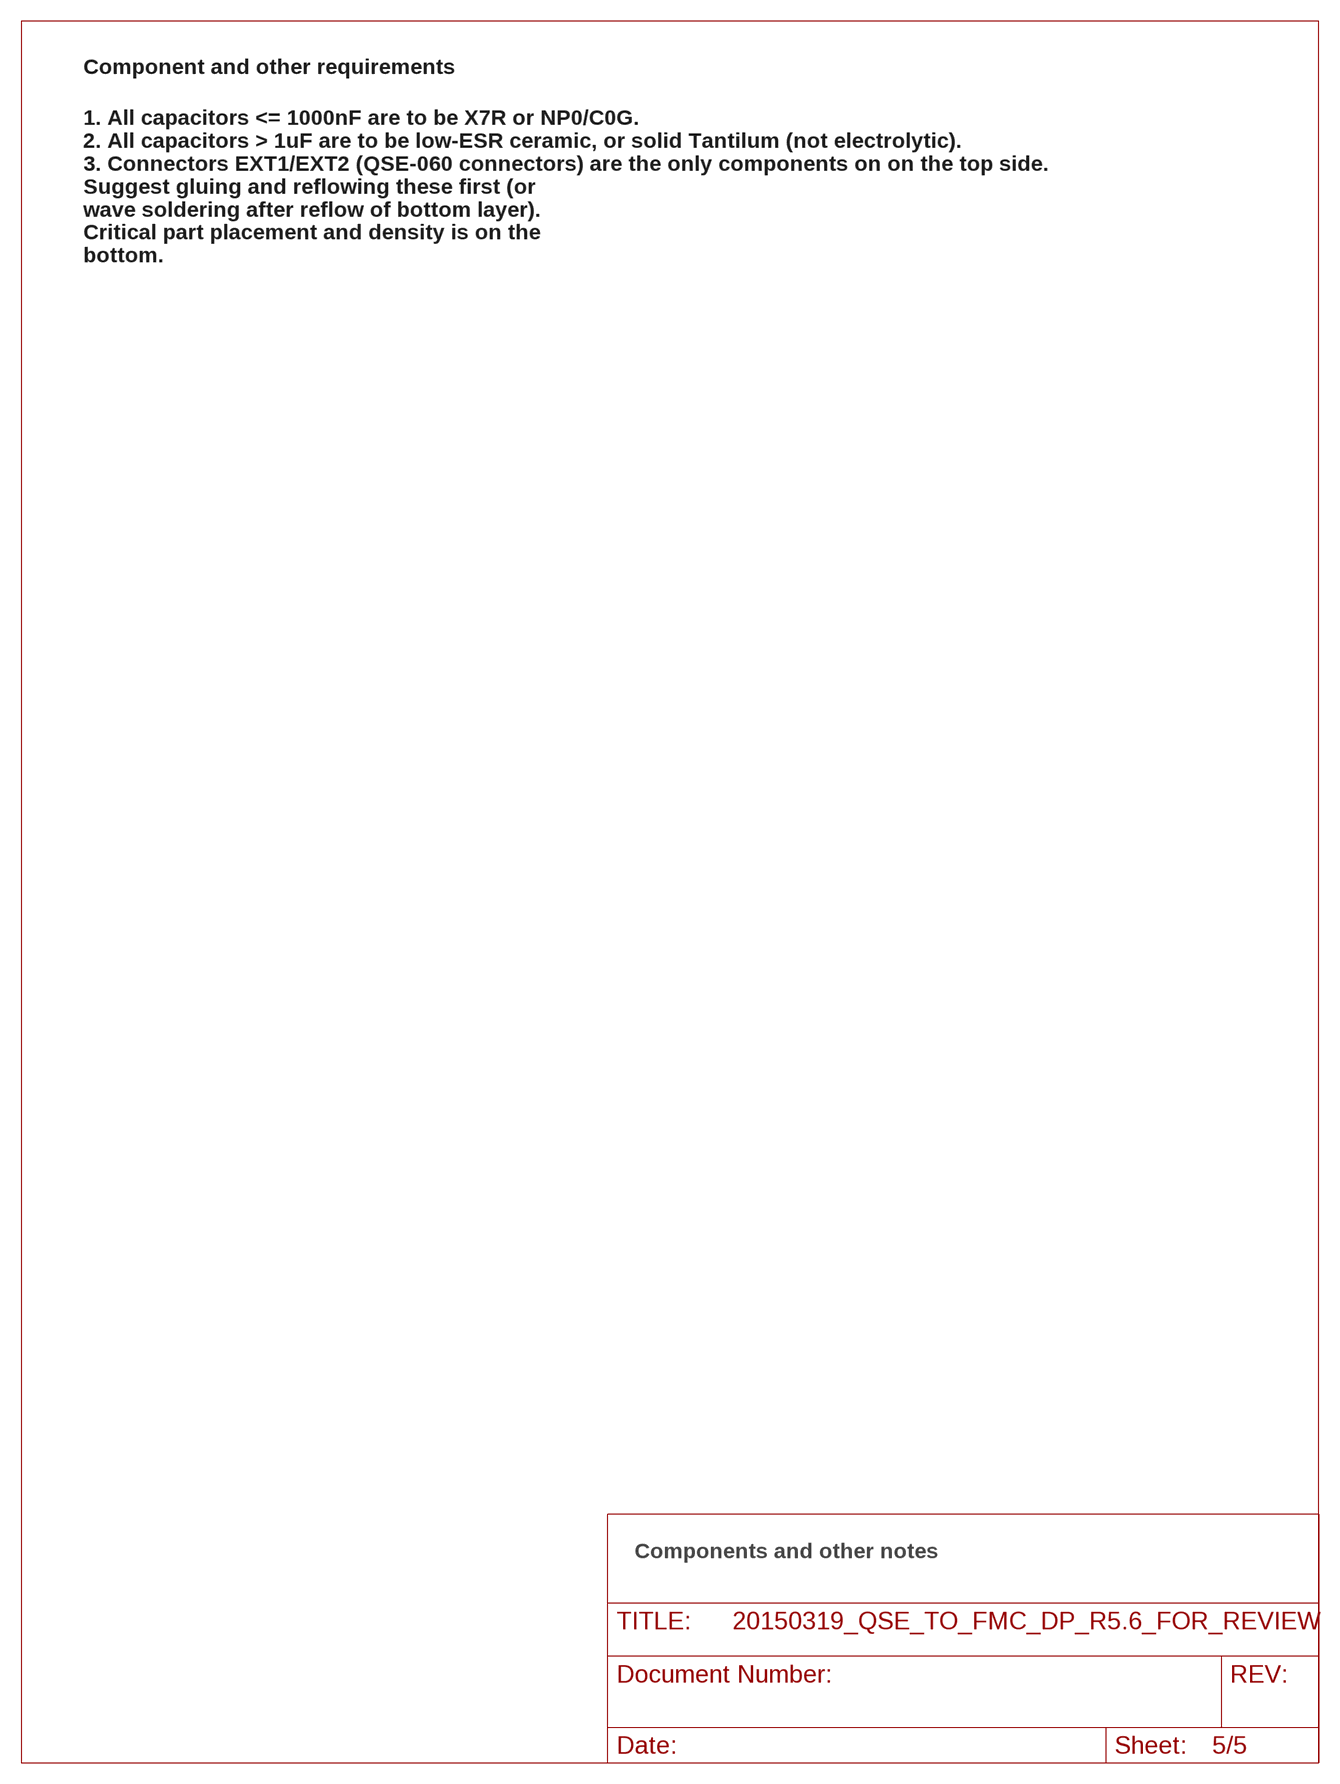
[diagram p4: schematic, sheet 5]

### Notes on the sheet
- Component and other requirements
- 1. All capacitors <= 1000nF are to be X7R or NP0/C0G. 
  2. All capacitors > 1uF are to be low-ESR ceramic, or solid Tantilum (not electrolytic).
  3. Connectors EXT1/EXT2 (QSE-060 connectors) are the only components on on the top side.
  Suggest gluing and reflowing these first (or 
  wave soldering after reflow of bottom layer).
  Critical part placement and density is on the
  bottom.
- Components and other notes

## Power pins joined to a net without a drawn wire
PWR_OUT: U206.P$20(PWR_OUT)

## Library data of the parts
C100 C101 C201-C210 C217-C220 C222-C225 = Murata_By_element14_Batch_1:GRM155R71C104KA88D: CAPACITOR, 0402; MPN: GRM155R71C104KA88D; OC_FARNELL: 8819742; OC_NEWARK: 38K1647; SUPPLIER: Murata; TOLERANCE: ±10%; VOLTAGERATING: 16V
C102 C216 C221 C226 C323 C324 C326 C330 = Murata_By_element14_Batch_1:GRM155R61A105KE15D: CAPACITOR, 0402; MANUFACTURER: MURATA; MPN: GRM155R61A105KE15D; OC_FARNELL: 1735523; OC_NEWARK: 24R6333; PART#: GRM188B31A225KE33; SUPPLIER: Murata; TOLERANCE: ±10%; VOLTAGERATING: 10V
C211-C215 C309 C311 C314 = Murata_By_element14_Batch_1:GRM155R71C104KA88D: CAPACITOR, 0402; MANUFACTURER: MURATA; MPN: GRM155R71C104KA88D; OC_FARNELL: 8819742; OC_NEWARK: 38K1647; PART#: GRM188B31H104MA92; SUPPLIER: Murata; TOLERANCE: ±10%; VOLTAGERATING: 16V
C301 C302 = Murata_By_element14_Batch_1:GRM155R71E103KA01D: CAPACITOR, 0402; MPN: GRM155R71E103KA01D; OC_FARNELL: 8819734; OC_NEWARK: 37K6460; SUPPLIER: Murata; TOLERANCE: ±10%; VOLTAGERATING: 25V
C303 C304 = Murata_By_element14_Batch_1:GRM188R60J106ME47D: CAPACITOR, 0603; MPN: GRM188R60J106ME47D; OC_FARNELL: 1735528; OC_NEWARK: 24R6334; SUPPLIER: Murata; TOLERANCE: ±20%; VOLTAGERATING: 6.3V
C305 C316 C317 = Murata_By_element14_Batch_1:GRM155R71E103KA01D: CAPACITOR, 0402; MANUFACTURER: MURATA; MPN: GRM155R71E103KA01D; OC_FARNELL: 8819734; OC_NEWARK: 37K6460; PART#: GRM1885C1H103JA01; SUPPLIER: Murata; TOLERANCE: ±10%; VOLTAGERATING: 25V
C306 C307 C310 C312 C320 C322 = Murata_By_element14_Batch_1:GRM1555C1H102JA01D: CAPACITOR, 0402; MANUFACTURER: MURATA; MPN: GRM1555C1H102JA01D; OC_FARNELL: 8819556; OC_NEWARK: 38K1651; PART#: GRM1885C1E102JA01; SUPPLIER: Murata; TOLERANCE: ±5%; VOLTAGERATING: 50V
C308 = Murata_By_element14_Batch_1:GRM188R60J106ME47D: CAPACITOR, 0603; MANUFACTURER: MURATA; MPN: GRM188R60J106ME47D; OC_FARNELL: 1735528; OC_NEWARK: 24R6334; SUPPLIER: Murata; TOLERANCE: ±20%; VOLTAGERATING: 6.3V
C313 C319 C325 C328 = Murata_By_element14_Batch_1:GRM188R60J106ME47D: CAPACITOR, 0603; MF: KEMET; MPN: GRM188R60J106ME47D; OC_FARNELL: 1735528; OC_NEWARK: 24R6334; SUPPLIER: Murata; TOLERANCE: ±20%; VOLTAGERATING: 6.3V
C315 C321 C327 C331 = Murata_By_element14_Batch_1:GRM188R71H103KA01D: CAPACITOR, 0603; MPN: GRM188R71H103KA01D; OC_FARNELL: 8819980; OC_NEWARK: 97K0612; SUPPLIER: Murata; TOLERANCE: ±10%; VOLTAGERATING: 50V
C318 C329 = Murata_By_element14_Batch_1:GRM155R61A105KE15D: CAPACITOR, 0402; MANUFACTURER: MURATA; MPN: GRM155R61A105KE15D; OC_FARNELL: 1735523; OC_NEWARK: 24R6333; SUPPLIER: Murata; TOLERANCE: ±10%; VOLTAGERATING: 10V
D300 D302-D304 = Diodes_Inc_By_element14_Batch_1:BAS21W: SURFACE MOUNT FAST SWITCHING DIODE; MPN: BAS21W; OC_FARNELL: 1902407; OC_NEWARK: 55T0013; PACKAGE: SOT-323-3; SUPPLIER: DIODES INC.
D301 = diode:ZENER-DIODE: Z-Diode; MANUFACTURER: ON SEMI; PART#: 1SMB5914BT3G; POWER: 3W
F301 = fuse:MF-SMDF: MF-PSMF Series - PTC Resettable Fuses http://www.bourns.com/data/global/pdfs/mfpsmf.pdf MF-PSMF050X
H1-H4 = holes:MOUNT-PAD-ROUND: MOUNTING PAD, round; OC_NEWARK: unknown
J101 = con-coax:SMA-SMD: SMA 50 Ohm Straight Jack Receptacle - Surface Mount www.johnsoncomponents.com Source: http://catalog.digikey.com .. 142-0711-201, 205, 202, 206.pdf; DIGIKEY_SKU: 132134-10-ND; MF: Amphenol Connex; MPN: 132134-10; NOTE: SMD-mount SMA female jack; OC_FARNELL: unknown; OC_NEWARK: unknown
J102 = con-coax:SMA-SMD: SMA 50 Ohm Straight Jack Receptacle - Surface Mount www.johnsoncomponents.com Source: http://catalog.digikey.com .. 142-0711-201, 205, 202, 206.pdf; DIGIKEY_SKU: 132134-10-ND; MF: Amphenol Connex; MPN: 132134-10; NOTE: SMD SMA Female Jack; OC_FARNELL: unknown; OC_NEWARK: unknown
J300 J301 SJ201 = jumper:SJ: SMD solder JUMPER
J302 = con-wago-500:W237-102: WAGO SCREW CLAMP; MPN: 237-102; OC_FARNELL: unknown; OC_NEWARK: 70K9898
JP301 = jumper:JP2E: JUMPER
L301 = WE-CBF_HF:WE-CBF_HF: SMD EMI Suppression Ferrite Beads WE-CBF HF; MPN: 742841210; OC_FARNELL: 1748573; OC_NEWARK: 34R5893; PACKAGE: IND-0402_1; SUPPLIER: Wuerth Elektronik
L302 L305 = rcl:L-US: INDUCTOR, American symbol; MANUFACTURER: MURATA; PART#: BLM18HE152SN1
L303 L304 = WE-CBF:WE-CBF: SMD EMI Suppression Ferrite Beads WE-CBF - Excellent anti-EMI properties - Low DC-restistance - Impedances till 3000 ohms - Rated current up to 6 A -- Reliable Ni-Sn electrodes -- Perfect as data lined filter and for uncoupling of distribution voltage; MPN: 742792097; OC_FARNELL: 1635738; OC_NEWARK: 08P2386; PACKAGE: IND-0805; SUPPLIER: Wuerth Elektronik
L306 L307 = rcl:L-US: INDUCTOR, American symbol; MANUFACTURER: MURATA; PART#: BLM18HE601SN1
LED301 LED303 LED304 = led:LED: LED OSRAM: - CHIPLED LG R971, LG N971, LY N971, LG Q971, LY Q971, LO R971, LY R971 LH N974, LH R974 LS Q976, LO Q976, LY Q976 LO Q996 - Hyper CHIPLED LW Q18S LB Q993, LB Q99A, LB R99A - SideLED LS A670, LO A670, LY A670, LG A670, LP A670 LB A673, LV A673, LT A673, LW A673 LH A674 LY A675 LS A676, LA A676, LO A676, LY A676, LW A676 LS A679, LY A679, LG A679 - Hyper Micro SIDELED® LS Y876, LA Y876, LO Y876, LY Y876 LT Y87S - SmartLED LW L88C, LW L88S LB L89C, LB L89S, LG L890 LS L89K, LO L89K, LY L89K LS L896, LA L896, LO L896, LY L896 - TOPLED LS T670, LO T670, LY T670, LG T670, LP T670 LSG T670, LSP T670, LSY T670, LOP T670, LYG T670 LG T671, LOG T671, LSG T671 LB T673, LV T673, LT T673, LW T673 LH T674 LS T676, LA T676, LO T676, LY T676, LB T676, LH T676, LSB T676, LW T676 LB T67C, LV T67C, LT T67C, LS T67K, LO T67K, LY T67K, LW E67C LS E67B, LA E67B, LO E67B, LY E67B, LB E67C, LV E67C, LT E67C LW T67C LS T679, LY T679, LG T679 LS T770, LO T770, LY T770, LG T770, LP T770 LB T773, LV T773, LT T773, LW T773 LH T774 LS E675, LA E675, LY E675, LS T675 LS T776, LA T776, LO T776, LY T776, LB T776 LHGB T686 LT T68C, LB T68C - Hyper Mini TOPLED® LB M676 - Mini TOPLED Santana® LG M470 LS M47K, LO M47K, LY M47K Source: http://www.osram.convergy.de LUXEON: - LUMILED® LXK2-PW12-R00, LXK2-PW12-S00, LXK2-PW14-U00, LXK2-PW14-V00 LXK2-PM12-R00, LXK2-PM12-S00, LXK2-PM14-U00 LXK2-PE12-Q00, LXK2-PE12-R00, LXK2-PE12-S00, LXK2-PE14-T00, LXK2-PE14-U00 LXK2-PB12-K00, LXK2-PB12-L00, LXK2-PB12-M00, LXK2-PB14-N00, LXK2-PB14-P00, LXK2-PB14-Q00 LXK2-PR12-L00, LXK2-PR12-M00, LXK2-PR14-Q00, LXK2-PR14-R00 LXK2-PD12-Q00, LXK2-PD12-R00, LXK2-PD12-S00 LXK2-PH12-R00, LXK2-PH12-S00 LXK2-PL12-P00, LXK2-PL12-Q00, LXK2-PL12-R00 Source: www.luxeon.com KINGBRIGHT: KA-3528ASYC Source: www.kingbright.com; DIGIKEY_SKU: 475-1410-1-ND; IF: 20mA; MANUFACTURER: OSRAM; PART#: LG R971-KN-1; VF: 2.2V
LED302 = led:LED: LED OSRAM: - CHIPLED LG R971, LG N971, LY N971, LG Q971, LY Q971, LO R971, LY R971 LH N974, LH R974 LS Q976, LO Q976, LY Q976 LO Q996 - Hyper CHIPLED LW Q18S LB Q993, LB Q99A, LB R99A - SideLED LS A670, LO A670, LY A670, LG A670, LP A670 LB A673, LV A673, LT A673, LW A673 LH A674 LY A675 LS A676, LA A676, LO A676, LY A676, LW A676 LS A679, LY A679, LG A679 - Hyper Micro SIDELED® LS Y876, LA Y876, LO Y876, LY Y876 LT Y87S - SmartLED LW L88C, LW L88S LB L89C, LB L89S, LG L890 LS L89K, LO L89K, LY L89K LS L896, LA L896, LO L896, LY L896 - TOPLED LS T670, LO T670, LY T670, LG T670, LP T670 LSG T670, LSP T670, LSY T670, LOP T670, LYG T670 LG T671, LOG T671, LSG T671 LB T673, LV T673, LT T673, LW T673 LH T674 LS T676, LA T676, LO T676, LY T676, LB T676, LH T676, LSB T676, LW T676 LB T67C, LV T67C, LT T67C, LS T67K, LO T67K, LY T67K, LW E67C LS E67B, LA E67B, LO E67B, LY E67B, LB E67C, LV E67C, LT E67C LW T67C LS T679, LY T679, LG T679 LS T770, LO T770, LY T770, LG T770, LP T770 LB T773, LV T773, LT T773, LW T773 LH T774 LS E675, LA E675, LY E675, LS T675 LS T776, LA T776, LO T776, LY T776, LB T776 LHGB T686 LT T68C, LB T68C - Hyper Mini TOPLED® LB M676 - Mini TOPLED Santana® LG M470 LS M47K, LO M47K, LY M47K Source: http://www.osram.convergy.de LUXEON: - LUMILED® LXK2-PW12-R00, LXK2-PW12-S00, LXK2-PW14-U00, LXK2-PW14-V00 LXK2-PM12-R00, LXK2-PM12-S00, LXK2-PM14-U00 LXK2-PE12-Q00, LXK2-PE12-R00, LXK2-PE12-S00, LXK2-PE14-T00, LXK2-PE14-U00 LXK2-PB12-K00, LXK2-PB12-L00, LXK2-PB12-M00, LXK2-PB14-N00, LXK2-PB14-P00, LXK2-PB14-Q00 LXK2-PR12-L00, LXK2-PR12-M00, LXK2-PR14-Q00, LXK2-PR14-R00 LXK2-PD12-Q00, LXK2-PD12-R00, LXK2-PD12-S00 LXK2-PH12-R00, LXK2-PH12-S00 LXK2-PL12-P00, LXK2-PL12-Q00, LXK2-PL12-R00 Source: www.luxeon.com KINGBRIGHT: KA-3528ASYC Source: www.kingbright.com; DIGIKEY_SKU: 475-1410-1-ND; MANUFACTURER: OSRAM; PART#: LG R971-KN-1
LED305 = led:LED: LED OSRAM: - CHIPLED LG R971, LG N971, LY N971, LG Q971, LY Q971, LO R971, LY R971 LH N974, LH R974 LS Q976, LO Q976, LY Q976 LO Q996 - Hyper CHIPLED LW Q18S LB Q993, LB Q99A, LB R99A - SideLED LS A670, LO A670, LY A670, LG A670, LP A670 LB A673, LV A673, LT A673, LW A673 LH A674 LY A675 LS A676, LA A676, LO A676, LY A676, LW A676 LS A679, LY A679, LG A679 - Hyper Micro SIDELED® LS Y876, LA Y876, LO Y876, LY Y876 LT Y87S - SmartLED LW L88C, LW L88S LB L89C, LB L89S, LG L890 LS L89K, LO L89K, LY L89K LS L896, LA L896, LO L896, LY L896 - TOPLED LS T670, LO T670, LY T670, LG T670, LP T670 LSG T670, LSP T670, LSY T670, LOP T670, LYG T670 LG T671, LOG T671, LSG T671 LB T673, LV T673, LT T673, LW T673 LH T674 LS T676, LA T676, LO T676, LY T676, LB T676, LH T676, LSB T676, LW T676 LB T67C, LV T67C, LT T67C, LS T67K, LO T67K, LY T67K, LW E67C LS E67B, LA E67B, LO E67B, LY E67B, LB E67C, LV E67C, LT E67C LW T67C LS T679, LY T679, LG T679 LS T770, LO T770, LY T770, LG T770, LP T770 LB T773, LV T773, LT T773, LW T773 LH T774 LS E675, LA E675, LY E675, LS T675 LS T776, LA T776, LO T776, LY T776, LB T776 LHGB T686 LT T68C, LB T68C - Hyper Mini TOPLED® LB M676 - Mini TOPLED Santana® LG M470 LS M47K, LO M47K, LY M47K Source: http://www.osram.convergy.de LUXEON: - LUMILED® LXK2-PW12-R00, LXK2-PW12-S00, LXK2-PW14-U00, LXK2-PW14-V00 LXK2-PM12-R00, LXK2-PM12-S00, LXK2-PM14-U00 LXK2-PE12-Q00, LXK2-PE12-R00, LXK2-PE12-S00, LXK2-PE14-T00, LXK2-PE14-U00 LXK2-PB12-K00, LXK2-PB12-L00, LXK2-PB12-M00, LXK2-PB14-N00, LXK2-PB14-P00, LXK2-PB14-Q00 LXK2-PR12-L00, LXK2-PR12-M00, LXK2-PR14-Q00, LXK2-PR14-R00 LXK2-PD12-Q00, LXK2-PD12-R00, LXK2-PD12-S00 LXK2-PH12-R00, LXK2-PH12-S00 LXK2-PL12-P00, LXK2-PL12-Q00, LXK2-PL12-R00 Source: www.luxeon.com KINGBRIGHT: KA-3528ASYC Source: www.kingbright.com; DIGIKEY_SKU: 350-2436-6-ND; IF: 20mA; MANUFACTURER: Dialight; PART#: 5975112407F; VF: 1.7V
R100 = Vishay_By_element14_Batch_1:CRCW04021M00JNED: RESISTOR, 0402; MPN: CRCW04021M00JNED; OC_FARNELL: 1514661; OC_NEWARK: 59M6694; SUPPLIER: VISHAY DALE ELECTRONICS; TOLERANCE: ±5%; VALUE: 1M Ohm; WATTAGE: 0.063 W
R201 R202 R303-R311 = Vishay_By_element14_Batch_1:CRCW040251R0FKED: RESISTOR, 0402; MPN: CRCW040251R0FKED; OC_FARNELL: 1563602; OC_NEWARK: 72M6802; SUPPLIER: VISHAY DALE ELECTRONICS; TOLERANCE: ±1%; VALUE: 51 Ohms; WATTAGE: 0.063 W
R203-R207 R302 = Vishay_By_element14_Batch_1:CRCW04021K50FKED: RESISTOR, 0402; MPN: CRCW04021K50FKED; OC_FARNELL: 1653201; OC_NEWARK: 52K6575; SUPPLIER: Vishay; TOLERANCE: ±1%; VALUE: 1.5K Ohms; WATTAGE: 0.063W
R208 R211 = Vishay_By_element14_Batch_1:CRCW04021M00FKED: RESISTOR, 0402; MPN: CRCW04021M00FKED; OC_FARNELL: 1469667; OC_NEWARK: 52K6593; SUPPLIER: Vishay; TOLERANCE: ±1%; VALUE: 1M Ohms; WATTAGE: 0.063W
R209 R210 = Vishay_By_element14_Batch_1:CRCW040210K0JNED: RESISTOR, 0402; MPN: CRCW040210K0JNED; OC_FARNELL: 1815062; OC_NEWARK: 19K8682; SUPPLIER: VISHAY DALE ELECTRONICS; TOLERANCE: ±5%; VALUE: 10K Ohms; WATTAGE: 0.063 W
R212 R214 = Vishay_By_element14_Batch_1:CRCW0402100KFKED: RESISTOR, 0402; MPN: CRCW0402100KFKED; OC_FARNELL: 1469671; OC_NEWARK: -; SUPPLIER: Vishay; TOLERANCE: ±1%; VALUE: 100K Ohms; WATTAGE: 0.063W
R213 = Vishay_By_element14_Batch_1:CRCW0402200KJNED: RESISTOR, 0402; MPN: CRCW0402200KJNED; OC_FARNELL: 1571696; OC_NEWARK: 89M6629; SUPPLIER: VISHAY DALE ELECTRONICS; TOLERANCE: ±5%; VALUE: 200K Ohms; WATTAGE: 0.063 W
R301 = Vishay_By_element14_Batch_1:CRCW04022K49FKED: RESISTOR, 0402; MPN: CRCW04022K49FKED; OC_FARNELL: 1469690; OC_NEWARK: 52K6803; SUPPLIER: Vishay; TOLERANCE: ±1%; VALUE: 2.49K Ohms; WATTAGE: 0.063W
SJ200 = jumper:SJ2W: SMD solder JUMPER
TP1-TP8 = testpad:TP: Test pad
U201 U203 U205 = TI:TPD4S010_DQA_10; DATASHEETURL: http://www.ti.com/lit/gpn/TPD4S010; DESCRIPTION: 4-Channel ESD Solution for High-Speed Differential Interface; FAMILY_NAME: ESD Solution; GENERIC_PART_NUMBER: TPD4S010; INDUSTRY_STD_PKG_TYPE: SON; MANUFACTURER: Texas Instruments; MANUFACTURER_PART_NUMBER: tpd4s010_dqa_10; PACKAGE_DESIGNATOR: DQA; PIN_COUNT: 10; VENDOR: Texas Instruments
U202 = TI:SN75DP130
U204 = TI:SN74GTL2010_PW_24; DATASHEETURL: http://www.ti.com/lit/gpn/SN74GTL2010; DESCRIPTION: 10-Bit Voltage Clamp; FAMILY_NAME: TTL/GTL/Open Drain FET Type Bidirectional Translator; GENERIC_PART_NUMBER: SN74GTL2010; INDUSTRY_STD_PKG_TYPE: TSSOP; MANUFACTURER: Texas Instruments; MANUFACTURER_PART_NUMBER: sn74gtl2010_pw_24; PACKAGE_DESIGNATOR: PW; PIN_COUNT: 24; VENDOR: Texas Instruments
U206 = con-molex:SD-47272
U303 = TI:LP5907_DBV_5; MANUFACTURER_PART_NUMBER: lp5907_dbv_5; VENDOR: Texas Instruments